# EAGLE schematic Main_Board_Schematic (EAGLE 9.7.0)

## Sheet 1 of 8
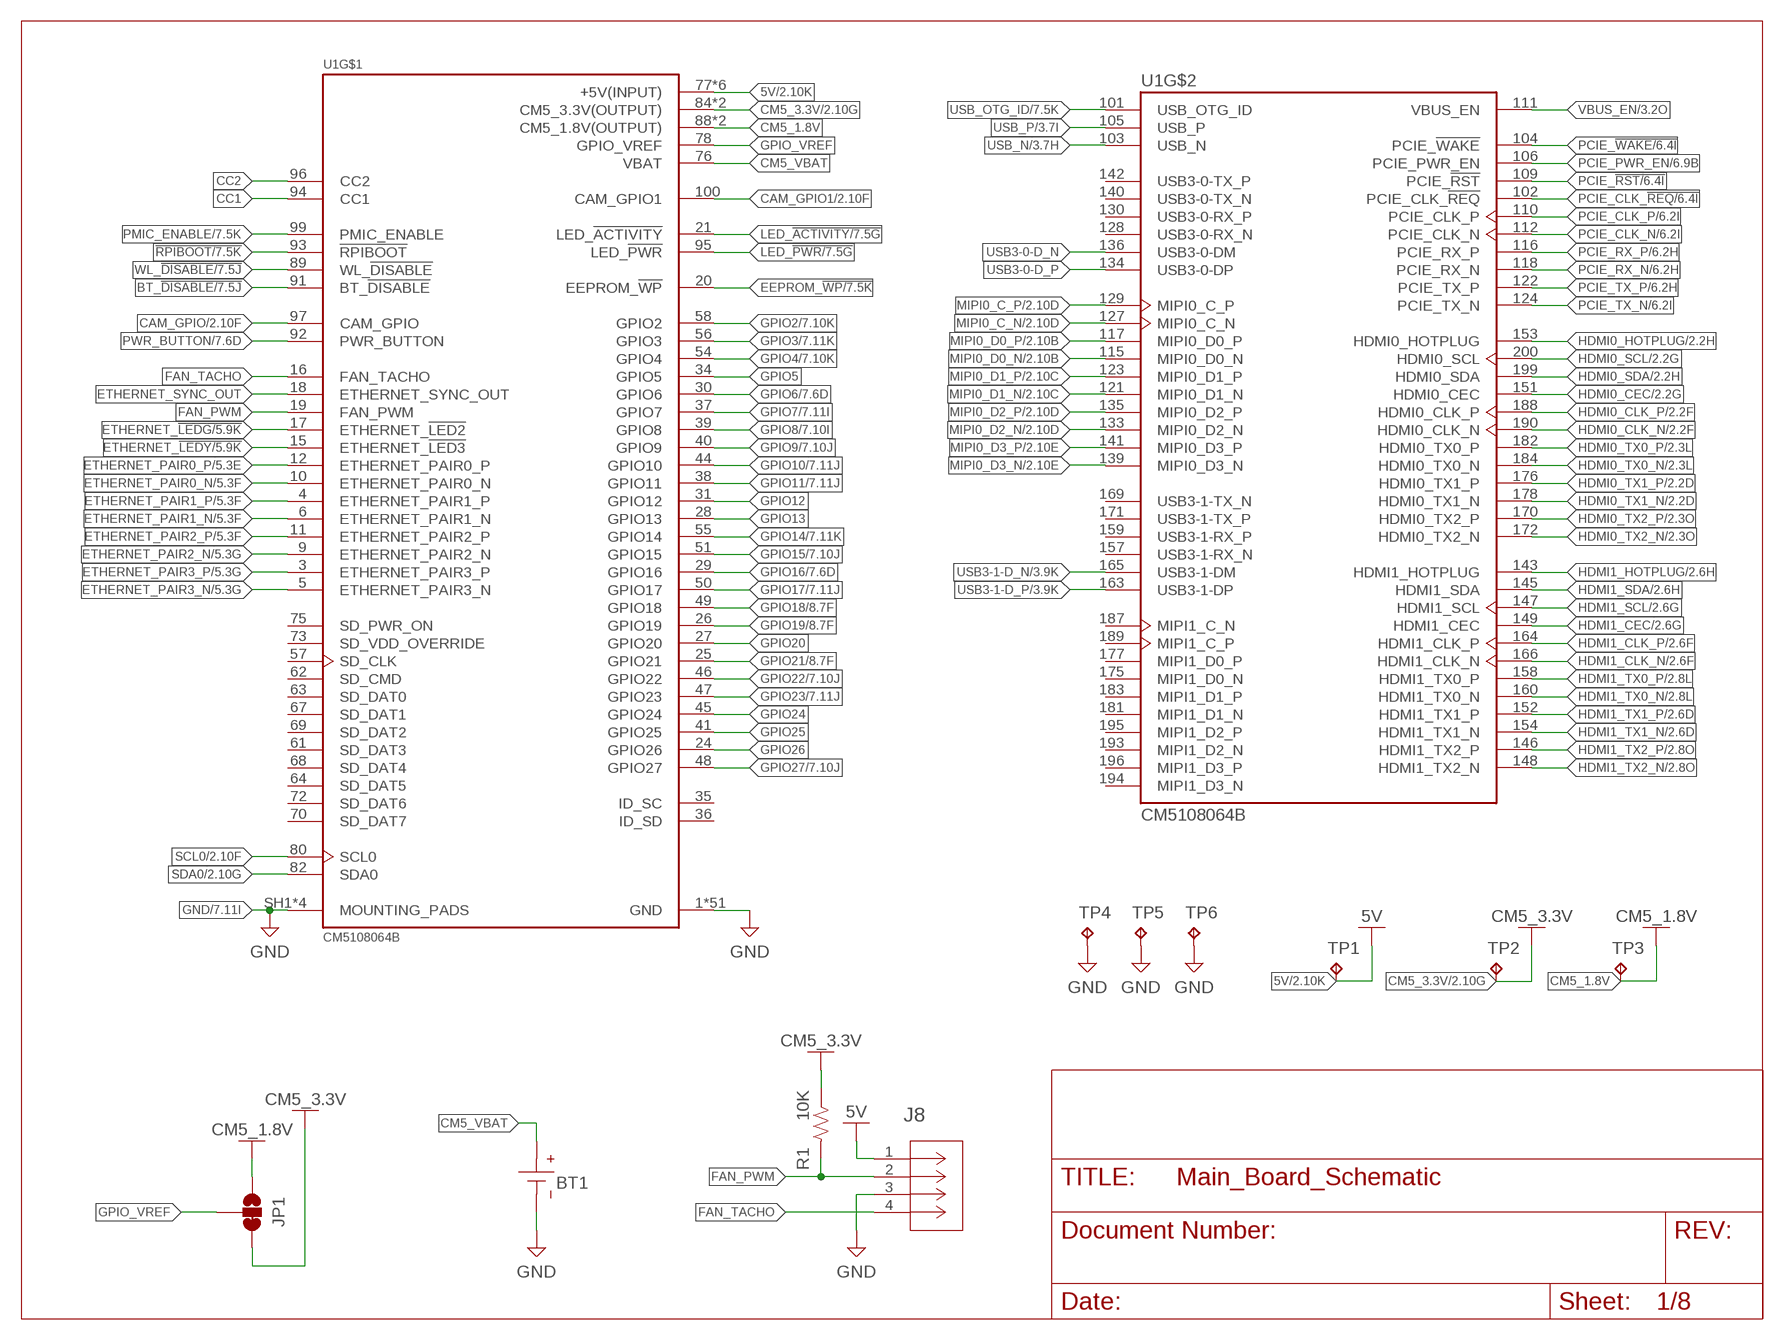
[diagram p0: schematic, sheet 1]

### Parts
BT1  COIN-CELL-SMT-3P-3002-BR2016  [BAT_3002]
J8  SM04B-SRSS-TBCONN_SM04B-SRSS-TB_JST  [CONN_SM04B-SRSS-TB_JST]
JP1  JUMPER-SMT_3_1-NC_TRACE_SILK  [SMT-JUMPER_3_1-NC_TRACE_SILK]
R1  10K  R-US_CHIP-0805(2012-METRIC)  [RESC2012X65]
TP1  TPB1,27  [B1,27]
TP2  TPB1,27  [B1,27]
TP3  TPB1,27  [B1,27]
TP4  TPB1,27  [B1,27]
TP5  TPB1,27  [B1,27]
TP6  TPB1,27  [B1,27]
U1  CM5108064B  [MODULE_CM5108064B]

### Nets
5V: J8.1 TP1.TP U1.77(+5V(INPUT)) U1.79(+5V(INPUT)) U1.81(+5V(INPUT)) U1.83(+5V(INPUT)) U1.85(+5V(INPUT)) U1.87(+5V(INPUT)) ; also sheet 2,3,6,7,8
!RPIBOOT: U1.93(!RPIBOOT) ; also sheet 7
BT_!DISABLE: U1.91(BT_!DISABLE) ; also sheet 7
CAM_GPIO: U1.97(CAM_GPIO) ; also sheet 2
CAM_GPIO1: U1.100(CAM_GPIO1) ; also sheet 2
CC1: U1.94(CC1)
CC2: U1.96(CC2)
CM5_1.8V: JP1.1 TP3.TP U1.88(CM5_1.8V(OUTPUT)) U1.90(CM5_1.8V(OUTPUT))
CM5_3.3V: JP1.3 R1.2 TP2.TP U1.84(CM5_3.3V(OUTPUT)) U1.86(CM5_3.3V(OUTPUT)) ; also sheet 2,3,4,5,7,8
CM5_VBAT: BT1.P1(+) BT1.P(+) U1.76(VBAT)
EEPROM_!WP: U1.20(EEPROM_!WP) ; also sheet 7
ETHERNET_!LEDG: U1.17(ETHERNET_!LED2) ; also sheet 5
ETHERNET_!LEDY: U1.15(ETHERNET_!LED3) ; also sheet 5
ETHERNET_PAIR0_N [100 ohm]: U1.10(ETHERNET_PAIR0_N) ; also sheet 5
ETHERNET_PAIR0_P [100 ohm]: U1.12(ETHERNET_PAIR0_P) ; also sheet 5
ETHERNET_PAIR1_N [100 ohm]: U1.6(ETHERNET_PAIR1_N) ; also sheet 5
ETHERNET_PAIR1_P [100 ohm]: U1.4(ETHERNET_PAIR1_P) ; also sheet 5
ETHERNET_PAIR2_N [100 ohm]: U1.9(ETHERNET_PAIR2_N) ; also sheet 5
ETHERNET_PAIR2_P [100 ohm]: U1.11(ETHERNET_PAIR2_P) ; also sheet 5
ETHERNET_PAIR3_N [100 ohm]: U1.5(ETHERNET_PAIR3_N) ; also sheet 5
ETHERNET_PAIR3_P [100 ohm]: U1.3(ETHERNET_PAIR3_P) ; also sheet 5
ETHERNET_SYNC_OUT: U1.18(ETHERNET_SYNC_OUT)
FAN_PWM: J8.2 R1.1 U1.19(FAN_PWM)
FAN_TACHO: J8.4 U1.16(FAN_TACHO)
GND: BT1.N(-) J8.3 TP4.TP TP5.TP TP6.TP U1.1(GND) U1.2(GND) U1.7(GND) U1.8(GND) U1.13(GND) U1.14(GND) U1.22(GND) U1.23(GND) U1.32(GND) U1.33(GND) U1.42(GND) U1.43(GND) U1.52(GND) U1.53(GND) U1.59(GND) U1.60(GND) U1.65(GND) U1.66(GND) U1.71(GND) U1.74(GND) U1.98(GND) U1.107(GND) U1.108(GND) U1.113(GND) U1.114(GND) U1.119(GND) U1.120(GND) U1.125(GND) U1.126(GND) U1.131(GND) U1.132(GND) U1.137(GND) U1.138(GND) U1.144(GND) U1.150(GND) U1.155(GND) U1.156(GND) U1.161(GND) U1.162(GND) U1.167(GND) U1.168(GND) U1.173(GND) U1.174(GND) U1.179(GND) U1.180(GND) U1.185(GND) U1.186(GND) U1.191(GND) U1.192(GND) U1.197(GND) U1.198(GND) U1.SH1(MOUNTING_PADS) U1.SH2(MOUNTING_PADS) U1.SH3(MOUNTING_PADS) U1.SH4(MOUNTING_PADS) ; also sheet 2,3,4,5,6,7,8
GPIO2: U1.58(GPIO2) ; also sheet 7
GPIO3: U1.56(GPIO3) ; also sheet 7
GPIO4: U1.54(GPIO4) ; also sheet 7
GPIO5: U1.34(GPIO5)
GPIO6: U1.30(GPIO6) ; also sheet 7
GPIO7: U1.37(GPIO7) ; also sheet 7
GPIO8: U1.39(GPIO8) ; also sheet 7
GPIO9: U1.40(GPIO9) ; also sheet 7
GPIO10: U1.44(GPIO10) ; also sheet 7
GPIO11: U1.38(GPIO11) ; also sheet 7
GPIO12: U1.31(GPIO12)
GPIO13: U1.28(GPIO13)
GPIO14: U1.55(GPIO14) ; also sheet 7
GPIO15: U1.51(GPIO15) ; also sheet 7
GPIO16: U1.29(GPIO16) ; also sheet 7
GPIO17: U1.50(GPIO17) ; also sheet 7
GPIO18: U1.49(GPIO18) ; also sheet 8
GPIO19: U1.26(GPIO19) ; also sheet 8
GPIO20: U1.27(GPIO20)
GPIO21: U1.25(GPIO21) ; also sheet 8
GPIO22: U1.46(GPIO22) ; also sheet 7
GPIO23: U1.47(GPIO23) ; also sheet 7
GPIO24: U1.45(GPIO24)
GPIO25: U1.41(GPIO25)
GPIO26: U1.24(GPIO26)
GPIO27: U1.48(GPIO27) ; also sheet 7
GPIO_VREF: JP1.2 U1.78(GPIO_VREF)
HDMI0_CEC: U1.151(HDMI0_CEC) ; also sheet 2
HDMI0_CLK_N [100 ohm]: U1.190(HDMI0_CLK_N) ; also sheet 2
HDMI0_CLK_P [100 ohm]: U1.188(HDMI0_CLK_P) ; also sheet 2
HDMI0_HOTPLUG: U1.153(HDMI0_HOTPLUG) ; also sheet 2
HDMI0_SCL: U1.200(HDMI0_SCL) ; also sheet 2
HDMI0_SDA: U1.199(HDMI0_SDA) ; also sheet 2
HDMI0_TX0_N [100 ohm]: U1.184(HDMI0_TX0_N) ; also sheet 2
HDMI0_TX0_P [100 ohm]: U1.182(HDMI0_TX0_P) ; also sheet 2
HDMI0_TX1_N [100 ohm]: U1.178(HDMI0_TX1_N) ; also sheet 2
HDMI0_TX1_P [100 ohm]: U1.176(HDMI0_TX1_P) ; also sheet 2
HDMI0_TX2_N [100 ohm]: U1.172(HDMI0_TX2_N) ; also sheet 2
HDMI0_TX2_P [100 ohm]: U1.170(HDMI0_TX2_P) ; also sheet 2
HDMI1_CEC: U1.149(HDMI1_CEC) ; also sheet 2
HDMI1_CLK_N [100 ohm]: U1.166(HDMI1_CLK_N) ; also sheet 2
HDMI1_CLK_P [100 ohm]: U1.164(HDMI1_CLK_P) ; also sheet 2
HDMI1_HOTPLUG: U1.143(HDMI1_HOTPLUG) ; also sheet 2
HDMI1_SCL: U1.147(HDMI1_SCL) ; also sheet 2
HDMI1_SDA: U1.145(HDMI1_SDA) ; also sheet 2
HDMI1_TX0_N [100 ohm]: U1.160(HDMI1_TX0_N) ; also sheet 2
HDMI1_TX0_P [100 ohm]: U1.158(HDMI1_TX0_P) ; also sheet 2
HDMI1_TX1_N [100 ohm]: U1.154(HDMI1_TX1_N) ; also sheet 2
HDMI1_TX1_P [100 ohm]: U1.152(HDMI1_TX1_P) ; also sheet 2
HDMI1_TX2_N [100 ohm]: U1.148(HDMI1_TX2_N) ; also sheet 2
HDMI1_TX2_P [100 ohm]: U1.146(HDMI1_TX2_P) ; also sheet 2
LED_!ACTIVITY: U1.21(LED_!ACTIVITY) ; also sheet 7
LED_!PWR: U1.95(LED_!PWR) ; also sheet 7
MIPI0_C_N [100 ohm]: U1.127(MIPI0_C_N) ; also sheet 2
MIPI0_C_P [100 ohm]: U1.129(MIPI0_C_P) ; also sheet 2
MIPI0_D0_N [100 ohm]: U1.115(MIPI0_D0_N) ; also sheet 2
MIPI0_D0_P [100 ohm]: U1.117(MIPI0_D0_P) ; also sheet 2
MIPI0_D1_N [100 ohm]: U1.121(MIPI0_D1_N) ; also sheet 2
MIPI0_D1_P [100 ohm]: U1.123(MIPI0_D1_P) ; also sheet 2
MIPI0_D2_N [100 ohm]: U1.133(MIPI0_D2_N) ; also sheet 2
MIPI0_D2_P [100 ohm]: U1.135(MIPI0_D2_P) ; also sheet 2
MIPI0_D3_N [100 ohm]: U1.139(MIPI0_D3_N) ; also sheet 2
MIPI0_D3_P [100 ohm]: U1.141(MIPI0_D3_P) ; also sheet 2
PCIE_!RST: U1.109(PCIE_!RST) ; also sheet 6
PCIE_!WAKE: U1.104(PCIE_!WAKE) ; also sheet 6
PCIE_CLK_!REQ: U1.102(PCIE_CLK_!REQ) ; also sheet 6
PCIE_CLK_N [90 ohm]: U1.112(PCIE_CLK_N) ; also sheet 6
PCIE_CLK_P [90 ohm]: U1.110(PCIE_CLK_P) ; also sheet 6
PCIE_PWR_EN: U1.106(PCIE_PWR_EN) ; also sheet 6
PCIE_RX_N [90 ohm]: U1.118(PCIE_RX_N) ; also sheet 6
PCIE_RX_P [90 ohm]: U1.116(PCIE_RX_P) ; also sheet 6
PCIE_TX_N [90 ohm]: U1.124(PCIE_TX_N) ; also sheet 6
PCIE_TX_P [90 ohm]: U1.122(PCIE_TX_P) ; also sheet 6
PMIC_ENABLE: U1.99(PMIC_ENABLE) ; also sheet 7
PWR_BUTTON: U1.92(PWR_BUTTON) ; also sheet 7
SCL0: U1.80(SCL0) ; also sheet 2
SDA0: U1.82(SDA0) ; also sheet 2
USB3-0-D_N [90 ohm]: U1.136(USB3-0-DM)
USB3-0-D_P [90 ohm]: U1.134(USB3-0-DP)
USB3-1-D_N [90 ohm]: U1.165(USB3-1-DM) ; also sheet 3
USB3-1-D_P [90 ohm]: U1.163(USB3-1-DP) ; also sheet 3
USB_N [90 ohm]: U1.103(USB_N) ; also sheet 3
USB_OTG_ID: U1.101(USB_OTG_ID) ; also sheet 7
USB_P [90 ohm]: U1.105(USB_P) ; also sheet 3
VBUS_EN: U1.111(VBUS_EN) ; also sheet 3
WL_!DISABLE: U1.89(WL_!DISABLE) ; also sheet 7
Unconnected: U1.35(ID_SC) U1.36(ID_SD) U1.57(SD_CLK) U1.61(SD_DAT3) U1.62(SD_CMD) U1.63(SD_DAT0) U1.64(SD_DAT5) U1.67(SD_DAT1) U1.68(SD_DAT4) U1.69(SD_DAT2) U1.70(SD_DAT7) U1.72(SD_DAT6) U1.73(SD_VDD_OVERRIDE) U1.75(SD_PWR_ON) U1.128(USB3-0-RX_N) U1.130(USB3-0-RX_P) U1.140(USB3-0-TX_N) U1.142(USB3-0-TX_P) U1.157(USB3-1-RX_N) U1.159(USB3-1-RX_P) U1.169(USB3-1-TX_N) U1.171(USB3-1-TX_P) U1.175(MIPI1_D0_N) U1.177(MIPI1_D0_P) U1.181(MIPI1_D1_N) U1.183(MIPI1_D1_P) U1.187(MIPI1_C_N) U1.189(MIPI1_C_P) U1.193(MIPI1_D2_N) U1.194(MIPI1_D3_N) U1.195(MIPI1_D2_P) U1.196(MIPI1_D3_P)

## Sheet 2 of 8
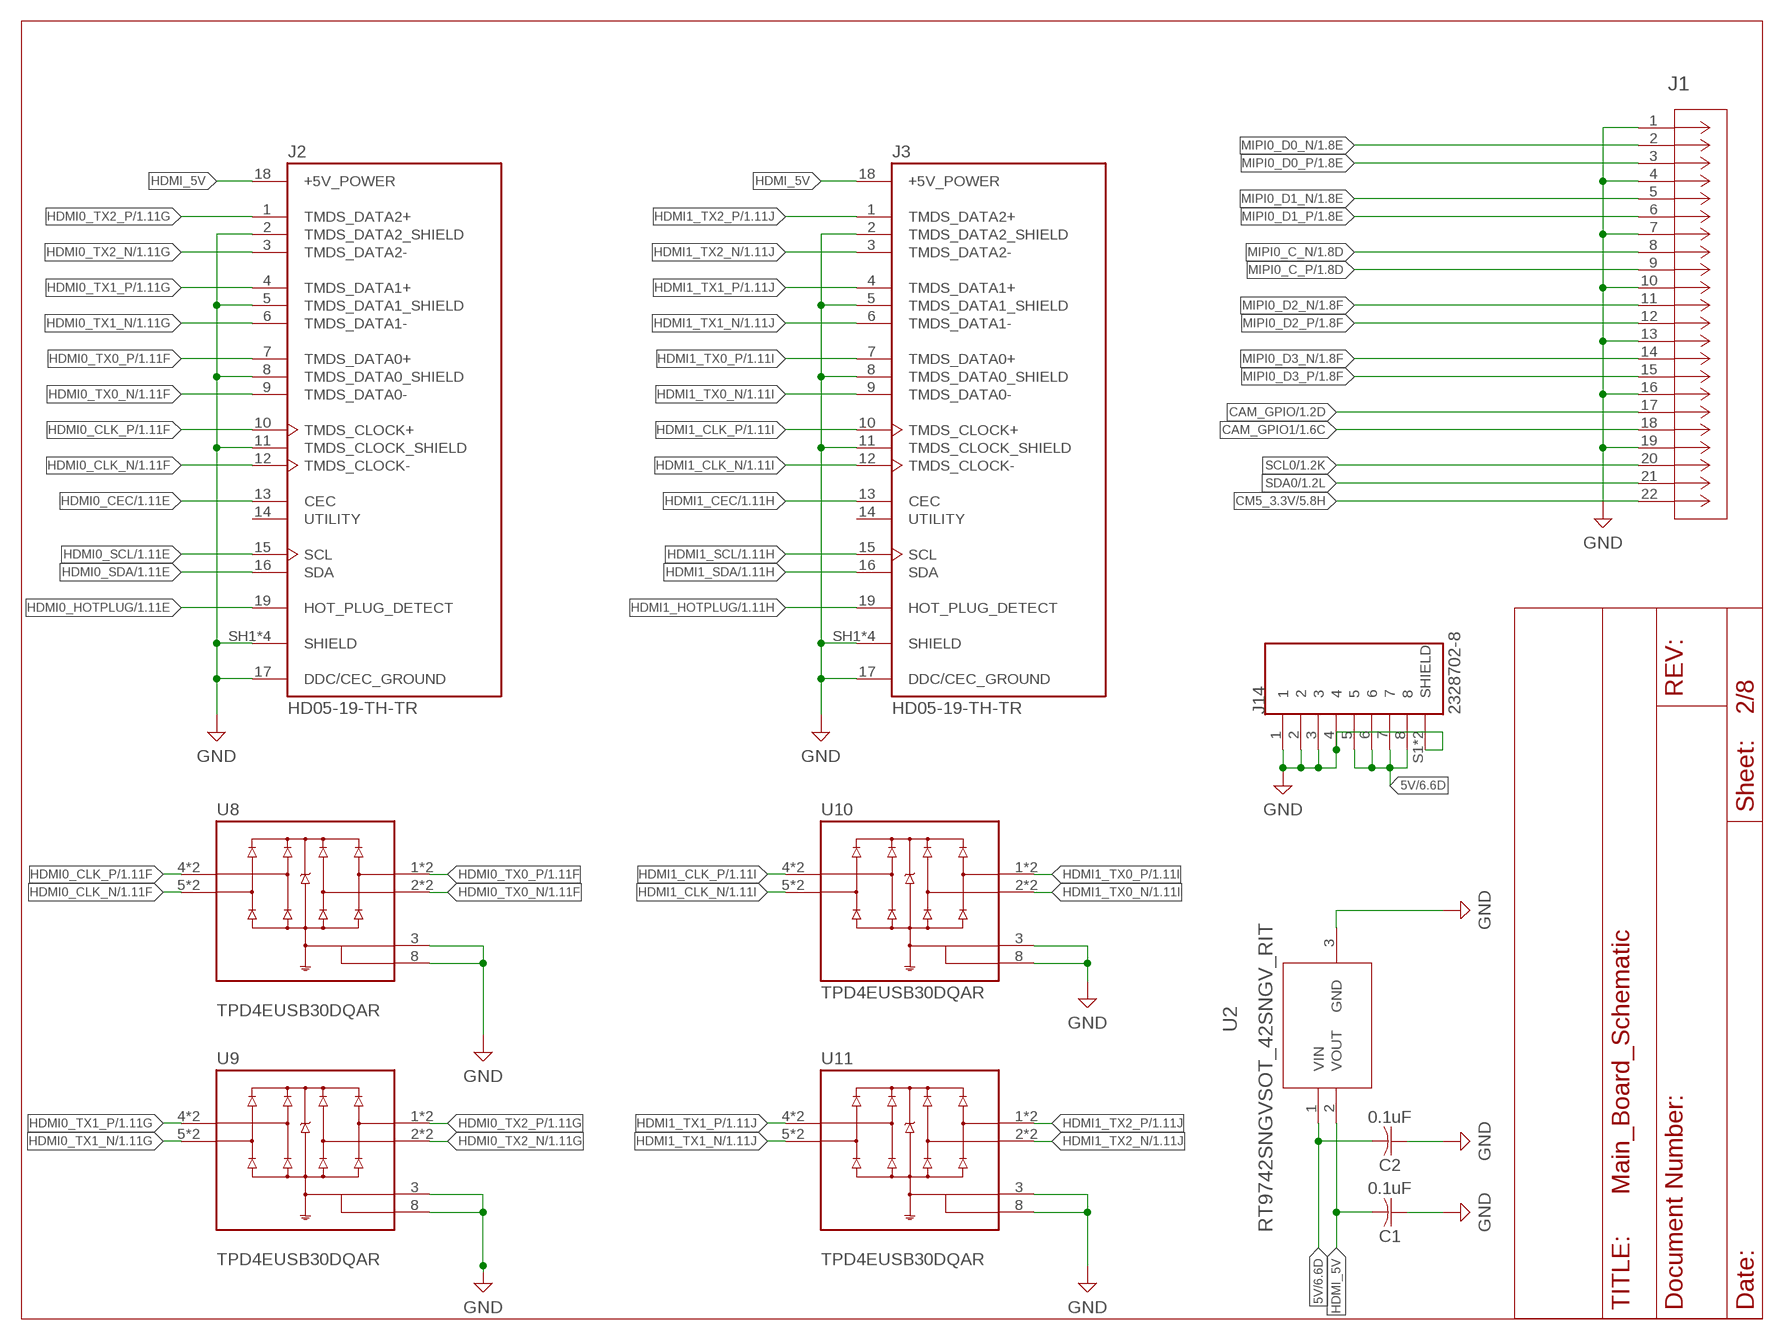
[diagram p1: schematic, sheet 2]

### Parts
C1  0.1uF  C-US_CHIP-0805(2012-METRIC)  [CAPC2012X110]
C2  0.1uF  C-US_CHIP-0805(2012-METRIC)  [CAPC2012X110]
J1  FH12-22S-0.5SH(55)CONN_FH12-22S-0.5SH(55)_HIR  [CONN_FH12-22S-0.5SH(55)_HIR]
J2  HD05-19-TH-TR  [SAMESKY_HD05-19-TH-TR]
J3  HD05-19-TH-TR  [SAMESKY_HD05-19-TH-TR]
J14  2328702-8  [TE_2328702-8]
U2  RT9742SNGVSOT_42SNGV_RIT  [SOT_42SNGV_RIT]
U8  TPD4EUSB30DQAR  [IC_TPD4EUSB30DQAR]
U9  TPD4EUSB30DQAR  [IC_TPD4EUSB30DQAR]
U10  TPD4EUSB30DQAR  [IC_TPD4EUSB30DQAR]
U11  TPD4EUSB30DQAR  [IC_TPD4EUSB30DQAR]

### Nets
5V: C2.2 J14.5 J14.6 J14.7 J14.8 U2.1(VIN) ; also sheet 1,3,6,7,8
CAM_GPIO: J1.17 ; also sheet 1
CAM_GPIO1: J1.18 ; also sheet 1
CM5_3.3V: J1.22 ; also sheet 1,3,4,5,7,8
GND: C1.1 C2.1 J1.1 J1.4 J1.7 J1.10 J1.13 J1.16 J1.19 J2.2(TMDS_DATA2_SHIELD) J2.5(TMDS_DATA1_SHIELD) J2.8(TMDS_DATA0_SHIELD) J2.11(TMDS_CLOCK_SHIELD) J2.17(DDC/CEC_GROUND) J2.SH1(SHIELD) J2.SH2(SHIELD) J2.SH3(SHIELD) J2.SH4(SHIELD) J3.2(TMDS_DATA2_SHIELD) J3.5(TMDS_DATA1_SHIELD) J3.8(TMDS_DATA0_SHIELD) J3.11(TMDS_CLOCK_SHIELD) J3.17(DDC/CEC_GROUND) J3.SH1(SHIELD) J3.SH2(SHIELD) J3.SH3(SHIELD) J3.SH4(SHIELD) J14.1 J14.2 J14.3 J14.4 J14.S1(SHIELD) J14.S2(SHIELD) U2.3(GND) U8.3(GND_3) U8.8(GND_8) U9.3(GND_3) U9.8(GND_8) U10.3(GND_3) U10.8(GND_8) U11.3(GND_3) U11.8(GND_8) ; also sheet 1,3,4,5,6,7,8
HDMI0_CEC: J2.13(CEC) ; also sheet 1
HDMI0_CLK_N [100 ohm]: J2.12(TMDS_CLOCK-) U8.5(D2-) U8.6(D2-) ; also sheet 1
HDMI0_CLK_P [100 ohm]: J2.10(TMDS_CLOCK+) U8.4(D2+) U8.7(D2+) ; also sheet 1
HDMI0_HOTPLUG: J2.19(HOT_PLUG_DETECT) ; also sheet 1
HDMI0_SCL: J2.15(SCL) ; also sheet 1
HDMI0_SDA: J2.16(SDA) ; also sheet 1
HDMI0_TX0_N [100 ohm]: J2.9(TMDS_DATA0-) U8.2(D1-) U8.9(D1-) ; also sheet 1
HDMI0_TX0_P [100 ohm]: J2.7(TMDS_DATA0+) U8.1(D1+) U8.10(D1+) ; also sheet 1
HDMI0_TX1_N [100 ohm]: J2.6(TMDS_DATA1-) U9.5(D2-) U9.6(D2-) ; also sheet 1
HDMI0_TX1_P [100 ohm]: J2.4(TMDS_DATA1+) U9.4(D2+) U9.7(D2+) ; also sheet 1
HDMI0_TX2_N [100 ohm]: J2.3(TMDS_DATA2-) U9.2(D1-) U9.9(D1-) ; also sheet 1
HDMI0_TX2_P [100 ohm]: J2.1(TMDS_DATA2+) U9.1(D1+) U9.10(D1+) ; also sheet 1
HDMI1_CEC: J3.13(CEC) ; also sheet 1
HDMI1_CLK_N [100 ohm]: J3.12(TMDS_CLOCK-) U10.5(D2-) U10.6(D2-) ; also sheet 1
HDMI1_CLK_P [100 ohm]: J3.10(TMDS_CLOCK+) U10.4(D2+) U10.7(D2+) ; also sheet 1
HDMI1_HOTPLUG: J3.19(HOT_PLUG_DETECT) ; also sheet 1
HDMI1_SCL: J3.15(SCL) ; also sheet 1
HDMI1_SDA: J3.16(SDA) ; also sheet 1
HDMI1_TX0_N [100 ohm]: J3.9(TMDS_DATA0-) U10.2(D1-) U10.9(D1-) ; also sheet 1
HDMI1_TX0_P [100 ohm]: J3.7(TMDS_DATA0+) U10.1(D1+) U10.10(D1+) ; also sheet 1
HDMI1_TX1_N [100 ohm]: J3.6(TMDS_DATA1-) U11.5(D2-) U11.6(D2-) ; also sheet 1
HDMI1_TX1_P [100 ohm]: J3.4(TMDS_DATA1+) U11.4(D2+) U11.7(D2+) ; also sheet 1
HDMI1_TX2_N [100 ohm]: J3.3(TMDS_DATA2-) U11.2(D1-) U11.9(D1-) ; also sheet 1
HDMI1_TX2_P [100 ohm]: J3.1(TMDS_DATA2+) U11.1(D1+) U11.10(D1+) ; also sheet 1
HDMI_5V: C1.2 J2.18(+5V_POWER) J3.18(+5V_POWER) U2.2(VOUT)
MIPI0_C_N [100 ohm]: J1.8 ; also sheet 1
MIPI0_C_P [100 ohm]: J1.9 ; also sheet 1
MIPI0_D0_N [100 ohm]: J1.2 ; also sheet 1
MIPI0_D0_P [100 ohm]: J1.3 ; also sheet 1
MIPI0_D1_N [100 ohm]: J1.5 ; also sheet 1
MIPI0_D1_P [100 ohm]: J1.6 ; also sheet 1
MIPI0_D2_N [100 ohm]: J1.11 ; also sheet 1
MIPI0_D2_P [100 ohm]: J1.12 ; also sheet 1
MIPI0_D3_N [100 ohm]: J1.14 ; also sheet 1
MIPI0_D3_P [100 ohm]: J1.15 ; also sheet 1
SCL0: J1.20 ; also sheet 1
SDA0: J1.21 ; also sheet 1
Unconnected: J2.14(UTILITY) J3.14(UTILITY)

## Sheet 3 of 8
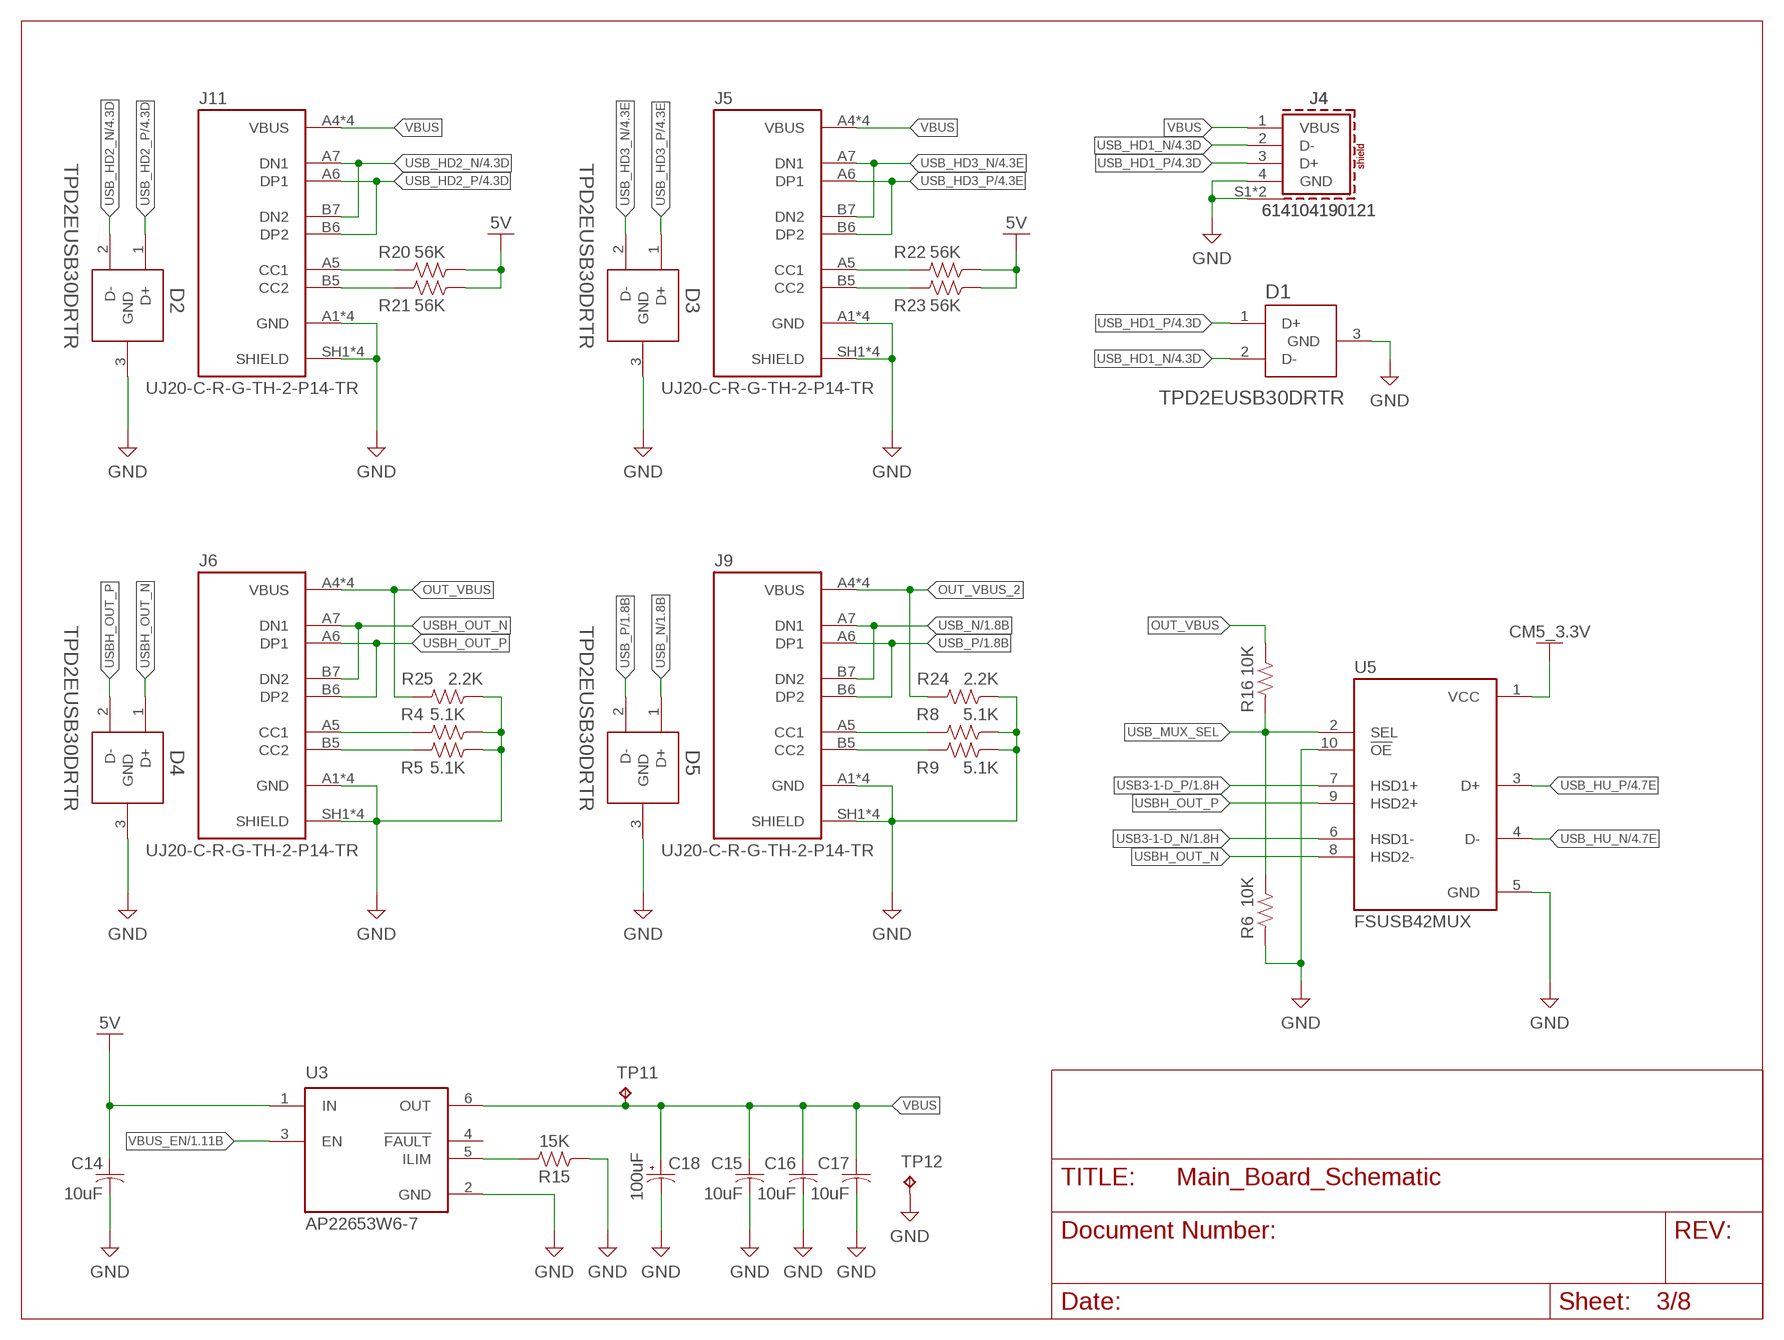
[diagram p2: schematic, sheet 3]

### Parts
C14  10uF  C-US_CHIP-1206(3216-METRIC)  [CAPC3216X135]
C15  10uF  C-US_CHIP-1206(3216-METRIC)  [CAPC3216X135]
C16  10uF  C-US_CHIP-1206(3216-METRIC)  [CAPC3216X135]
C17  10uF  C-US_CHIP-1206(3216-METRIC)  [CAPC3216X135]
C18  100uF  C-POL-US_TANTALUM-1411(3528-METRIC)  [CAPMP3528X210N]
D1  TPD2EUSB30DRTR  [SOTFL35P100X50-3N]
D2  TPD2EUSB30DRTR  [SOTFL35P100X50-3N]
D3  TPD2EUSB30DRTR  [SOTFL35P100X50-3N]
D4  TPD2EUSB30DRTR  [SOTFL35P100X50-3N]
D5  TPD2EUSB30DRTR  [SOTFL35P100X50-3N]
J4  614104190121  [614104190121]
J5  UJ20-C-R-G-TH-2-P14-TR  [SAMESKY_UJ20-C-R-G-TH-2-P14-TR]
J6  UJ20-C-R-G-TH-2-P14-TR  [SAMESKY_UJ20-C-R-G-TH-2-P14-TR]
J9  UJ20-C-R-G-TH-2-P14-TR  [SAMESKY_UJ20-C-R-G-TH-2-P14-TR]
J11  UJ20-C-R-G-TH-2-P14-TR  [SAMESKY_UJ20-C-R-G-TH-2-P14-TR]
R4  5.1K  R-US_CHIP-0805(2012-METRIC)  [RESC2012X65]
R5  5.1K  R-US_CHIP-0805(2012-METRIC)  [RESC2012X65]
R6  10K  R-US_CHIP-0805(2012-METRIC)  [RESC2012X65]
R8  5.1K  R-US_CHIP-0805(2012-METRIC)  [RESC2012X65]
R9  5.1K  R-US_CHIP-0805(2012-METRIC)  [RESC2012X65]
R15  15K  R-US_CHIP-0805(2012-METRIC)  [RESC2012X65]
R16  10K  R-US_CHIP-0805(2012-METRIC)  [RESC2012X65]
R20  56K  R-US_CHIP-0805(2012-METRIC)  [RESC2012X65]
R21  56K  R-US_CHIP-0805(2012-METRIC)  [RESC2012X65]
R22  56K  R-US_CHIP-0805(2012-METRIC)  [RESC2012X65]
R23  56K  R-US_CHIP-0805(2012-METRIC)  [RESC2012X65]
R24  2.2K  R-US_CHIP-0805(2012-METRIC)  [RESC2012X65]
R25  2.2K  R-US_CHIP-0805(2012-METRIC)  [RESC2012X65]
TP11  TPB1,27  [B1,27]
TP12  TPB1,27  [B1,27]
U3  AP22653W6-7  [SOT95P280X145-6N]
U5  FSUSB42MUX  [SOP50P490X110-10N]

### Nets
5V: C14.1 R20.1 R21.1 R22.1 R23.1 U3.1(IN) ; also sheet 1,2,6,7,8
CM5_3.3V: U5.1(VCC) ; also sheet 1,2,4,5,7,8
GND: C14.2 C15.2 C16.2 C17.2 C18.2(-) D1.3(GND) D2.3(GND) D3.3(GND) D4.3(GND) D5.3(GND) J4.4(GND) J4.S1(SHIELD) J4.S2(SHIELD) J5.A1(GND) J5.A12(GND) J5.B1(GND) J5.B12(GND) J5.SH1(SHIELD) J5.SH2(SHIELD) J5.SH3(SHIELD) J5.SH4(SHIELD) J6.A1(GND) J6.A12(GND) J6.B1(GND) J6.B12(GND) J6.SH1(SHIELD) J6.SH2(SHIELD) J6.SH3(SHIELD) J6.SH4(SHIELD) J9.A1(GND) J9.A12(GND) J9.B1(GND) J9.B12(GND) J9.SH1(SHIELD) J9.SH2(SHIELD) J9.SH3(SHIELD) J9.SH4(SHIELD) J11.A1(GND) J11.A12(GND) J11.B1(GND) J11.B12(GND) J11.SH1(SHIELD) J11.SH2(SHIELD) J11.SH3(SHIELD) J11.SH4(SHIELD) R4.1 R5.1 R6.1 R8.1 R9.1 R15.1 R24.1 R25.1 TP12.TP U3.2(GND) U5.5(GND) U5.10(!OE) ; also sheet 1,2,4,5,6,7,8
N$1: J11.A5(CC1) R20.2
N$2: J5.A5(CC1) R22.2
N$5: J9.A5(CC1) R8.2
N$6: J9.B5(CC2) R9.2
N$11: J6.A5(CC1) R4.2
N$12: J6.B5(CC2) R5.2
N$14: R15.2 U3.5(ILIM)
N$17: J5.B5(CC2) R23.2
N$18: J11.B5(CC2) R21.2
OUT_VBUS: J6.A4(VBUS) J6.A9(VBUS) J6.B4(VBUS) J6.B9(VBUS) R16.2 R25.2
OUT_VBUS_2: J9.A4(VBUS) J9.A9(VBUS) J9.B4(VBUS) J9.B9(VBUS) R24.2
USB3-1-D_N [90 ohm]: U5.6(HSD1-) ; also sheet 1
USB3-1-D_P [90 ohm]: U5.7(HSD1+) ; also sheet 1
USB_HD1_N [90 ohm]: D1.2(D-) J4.2(D-) ; also sheet 4
USB_HD1_P [90 ohm]: D1.1(D+) J4.3(D+) ; also sheet 4
USB_HD2_N [90 ohm]: D2.2(D-) J11.A7(DN1) J11.B7(DN2) ; also sheet 4
USB_HD2_P [90 ohm]: D2.1(D+) J11.A6(DP1) J11.B6(DP2) ; also sheet 4
USB_HD3_N [90 ohm]: D3.2(D-) J5.A7(DN1) J5.B7(DN2) ; also sheet 4
USB_HD3_P [90 ohm]: D3.1(D+) J5.A6(DP1) J5.B6(DP2) ; also sheet 4
USB_HU_N [90 ohm]: U5.4(D-) ; also sheet 4
USB_HU_P [90 ohm]: U5.3(D+) ; also sheet 4
USB_MUX_SEL: R6.2 R16.1 U5.2(SEL)
USB_N [90 ohm]: D5.1(D+) J9.A7(DN1) J9.B7(DN2) ; also sheet 1
USB_P [90 ohm]: D5.2(D-) J9.A6(DP1) J9.B6(DP2) ; also sheet 1
USBH_OUT_N [90 ohm]: D4.1(D+) J6.A7(DN1) J6.B7(DN2) U5.8(HSD2-)
USBH_OUT_P [90 ohm]: D4.2(D-) J6.A6(DP1) J6.B6(DP2) U5.9(HSD2+)
VBUS: C15.1 C16.1 C17.1 C18.1(+) J4.1(VBUS) J5.A4(VBUS) J5.A9(VBUS) J5.B4(VBUS) J5.B9(VBUS) J11.A4(VBUS) J11.A9(VBUS) J11.B4(VBUS) J11.B9(VBUS) TP11.TP U3.6(OUT)
VBUS_EN: U3.3(EN) ; also sheet 1
Unconnected: U3.4(!FAULT)

## Sheet 4 of 8
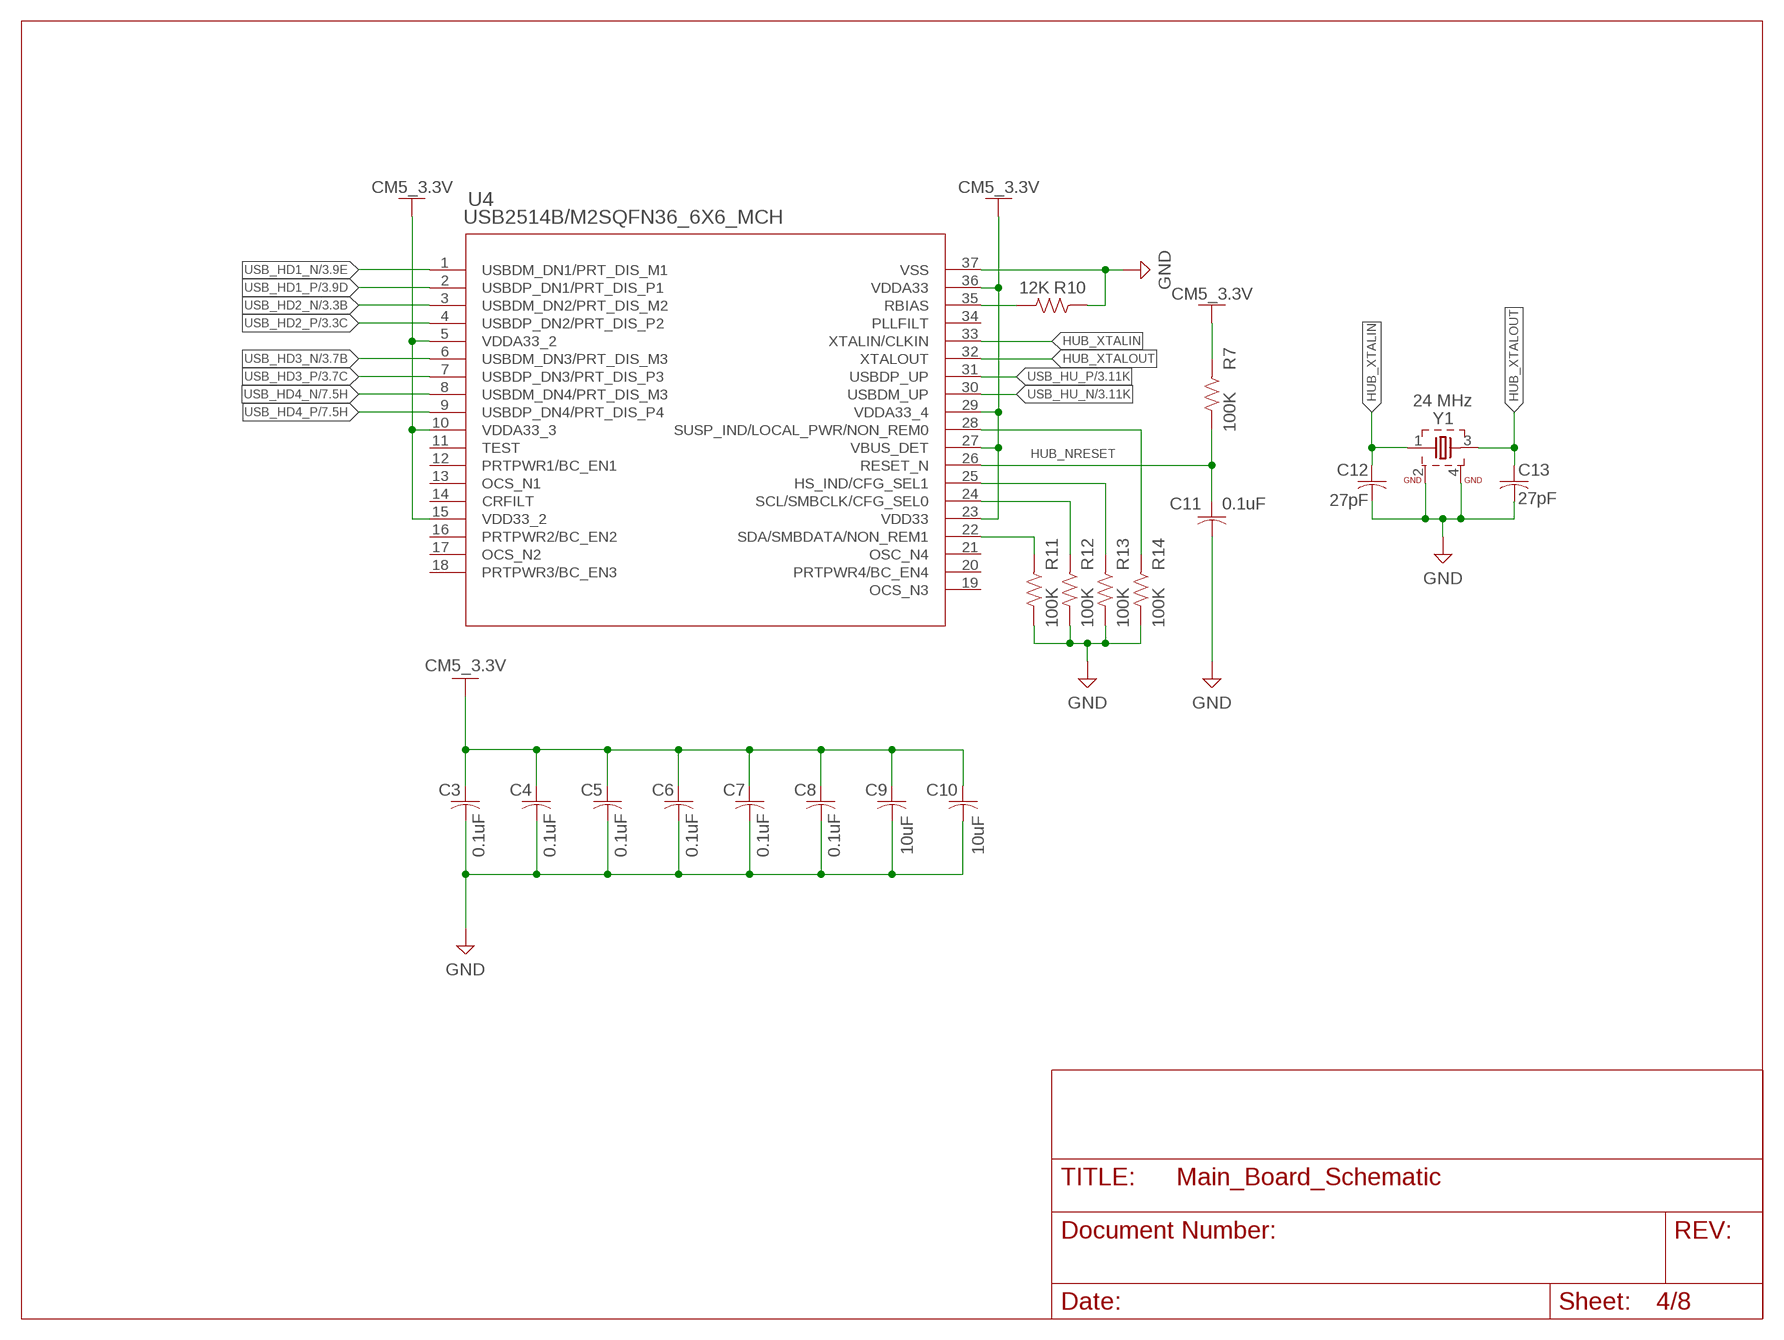
[diagram p3: schematic, sheet 4]

### Parts
C3  0.1uF  C-US_CHIP-0805(2012-METRIC)  [CAPC2012X110]
C4  0.1uF  C-US_CHIP-0805(2012-METRIC)  [CAPC2012X110]
C5  0.1uF  C-US_CHIP-0805(2012-METRIC)  [CAPC2012X110]
C6  0.1uF  C-US_CHIP-0805(2012-METRIC)  [CAPC2012X110]
C7  0.1uF  C-US_CHIP-0805(2012-METRIC)  [CAPC2012X110]
C8  0.1uF  C-US_CHIP-0805(2012-METRIC)  [CAPC2012X110]
C9  10uF  C-US_CHIP-1206(3216-METRIC)  [CAPC3216X135]
C10  10uF  C-US_CHIP-1206(3216-METRIC)  [CAPC3216X135]
C11  0.1uF  C-US_CHIP-0805(2012-METRIC)  [CAPC2012X110]
C12  27pF  C-US_CHIP-0805(2012-METRIC)  [CAPC2012X110]
C13  27pF  C-US_CHIP-0805(2012-METRIC)  [CAPC2012X110]
R7  100K  R-US_CHIP-0805(2012-METRIC)  [RESC2012X65]
R10  12K  R-US_CHIP-0805(2012-METRIC)  [RESC2012X65]
R11  100K  R-US_CHIP-0805(2012-METRIC)  [RESC2012X65]
R12  100K  R-US_CHIP-0805(2012-METRIC)  [RESC2012X65]
R13  100K  R-US_CHIP-0805(2012-METRIC)  [RESC2012X65]
R14  100K  R-US_CHIP-0805(2012-METRIC)  [RESC2012X65]
U4  USB2514B/M2SQFN36_6X6_MCH  [SQFN36_6X6_MCH]
Y1  24 MHz  WE-XTAL_CFPX-180_830058124  [WE-XTAL_CFPX-180]

### Nets
CM5_3.3V: C3.1 C4.1 C5.1 C6.1 C7.1 C8.1 C9.1 C10.1 R7.1 U4.5(VDDA33_2) U4.10(VDDA33_3) U4.15(VDD33_2) U4.23(VDD33) U4.27(VBUS_DET) U4.29(VDDA33_4) U4.36(VDDA33) ; also sheet 1,2,3,5,7,8
GND: C3.2 C4.2 C5.2 C6.2 C7.2 C8.2 C9.2 C10.2 C11.2 C12.2 C13.2 R10.1 R11.2 R12.2 R13.2 R14.2 U4.37(VSS) Y1.2(GND) Y1.4(GND1) ; also sheet 1,2,3,5,6,7,8
HUB_NRESET: C11.1 R7.2 U4.26(RESET_N)
HUB_XTALIN: C12.1 U4.33(XTALIN/CLKIN) Y1.1
HUB_XTALOUT: C13.1 U4.32(XTALOUT) Y1.3
N$3: R10.2 U4.35(RBIAS)
N$4: R11.1 U4.22(SDA/SMBDATA/NON_REM1)
N$7: R12.1 U4.24(SCL/SMBCLK/CFG_SEL0)
N$8: R13.1 U4.25(HS_IND/CFG_SEL1)
N$9: R14.1 U4.28(SUSP_IND/LOCAL_PWR/NON_REM0)
USB_HD1_N [90 ohm]: U4.1(USBDM_DN1/PRT_DIS_M1) ; also sheet 3
USB_HD1_P [90 ohm]: U4.2(USBDP_DN1/PRT_DIS_P1) ; also sheet 3
USB_HD2_N [90 ohm]: U4.3(USBDM_DN2/PRT_DIS_M2) ; also sheet 3
USB_HD2_P [90 ohm]: U4.4(USBDP_DN2/PRT_DIS_P2) ; also sheet 3
USB_HD3_N [90 ohm]: U4.6(USBDM_DN3/PRT_DIS_M3) ; also sheet 3
USB_HD3_P [90 ohm]: U4.7(USBDP_DN3/PRT_DIS_P3) ; also sheet 3
USB_HD4_N [90 ohm]: U4.8(USBDM_DN4/PRT_DIS_M3) ; also sheet 7
USB_HD4_P [90 ohm]: U4.9(USBDP_DN4/PRT_DIS_P4) ; also sheet 7
USB_HU_N [90 ohm]: U4.30(USBDM_UP) ; also sheet 3
USB_HU_P [90 ohm]: U4.31(USBDP_UP) ; also sheet 3
Unconnected: U4.11(TEST) U4.12(PRTPWR1/BC_EN1) U4.13(OCS_N1) U4.14(CRFILT) U4.16(PRTPWR2/BC_EN2) U4.17(OCS_N2) U4.18(PRTPWR3/BC_EN3) U4.19(OCS_N3) U4.20(PRTPWR4/BC_EN4) U4.21(OSC_N4) U4.34(PLLFILT)

## Sheet 5 of 8
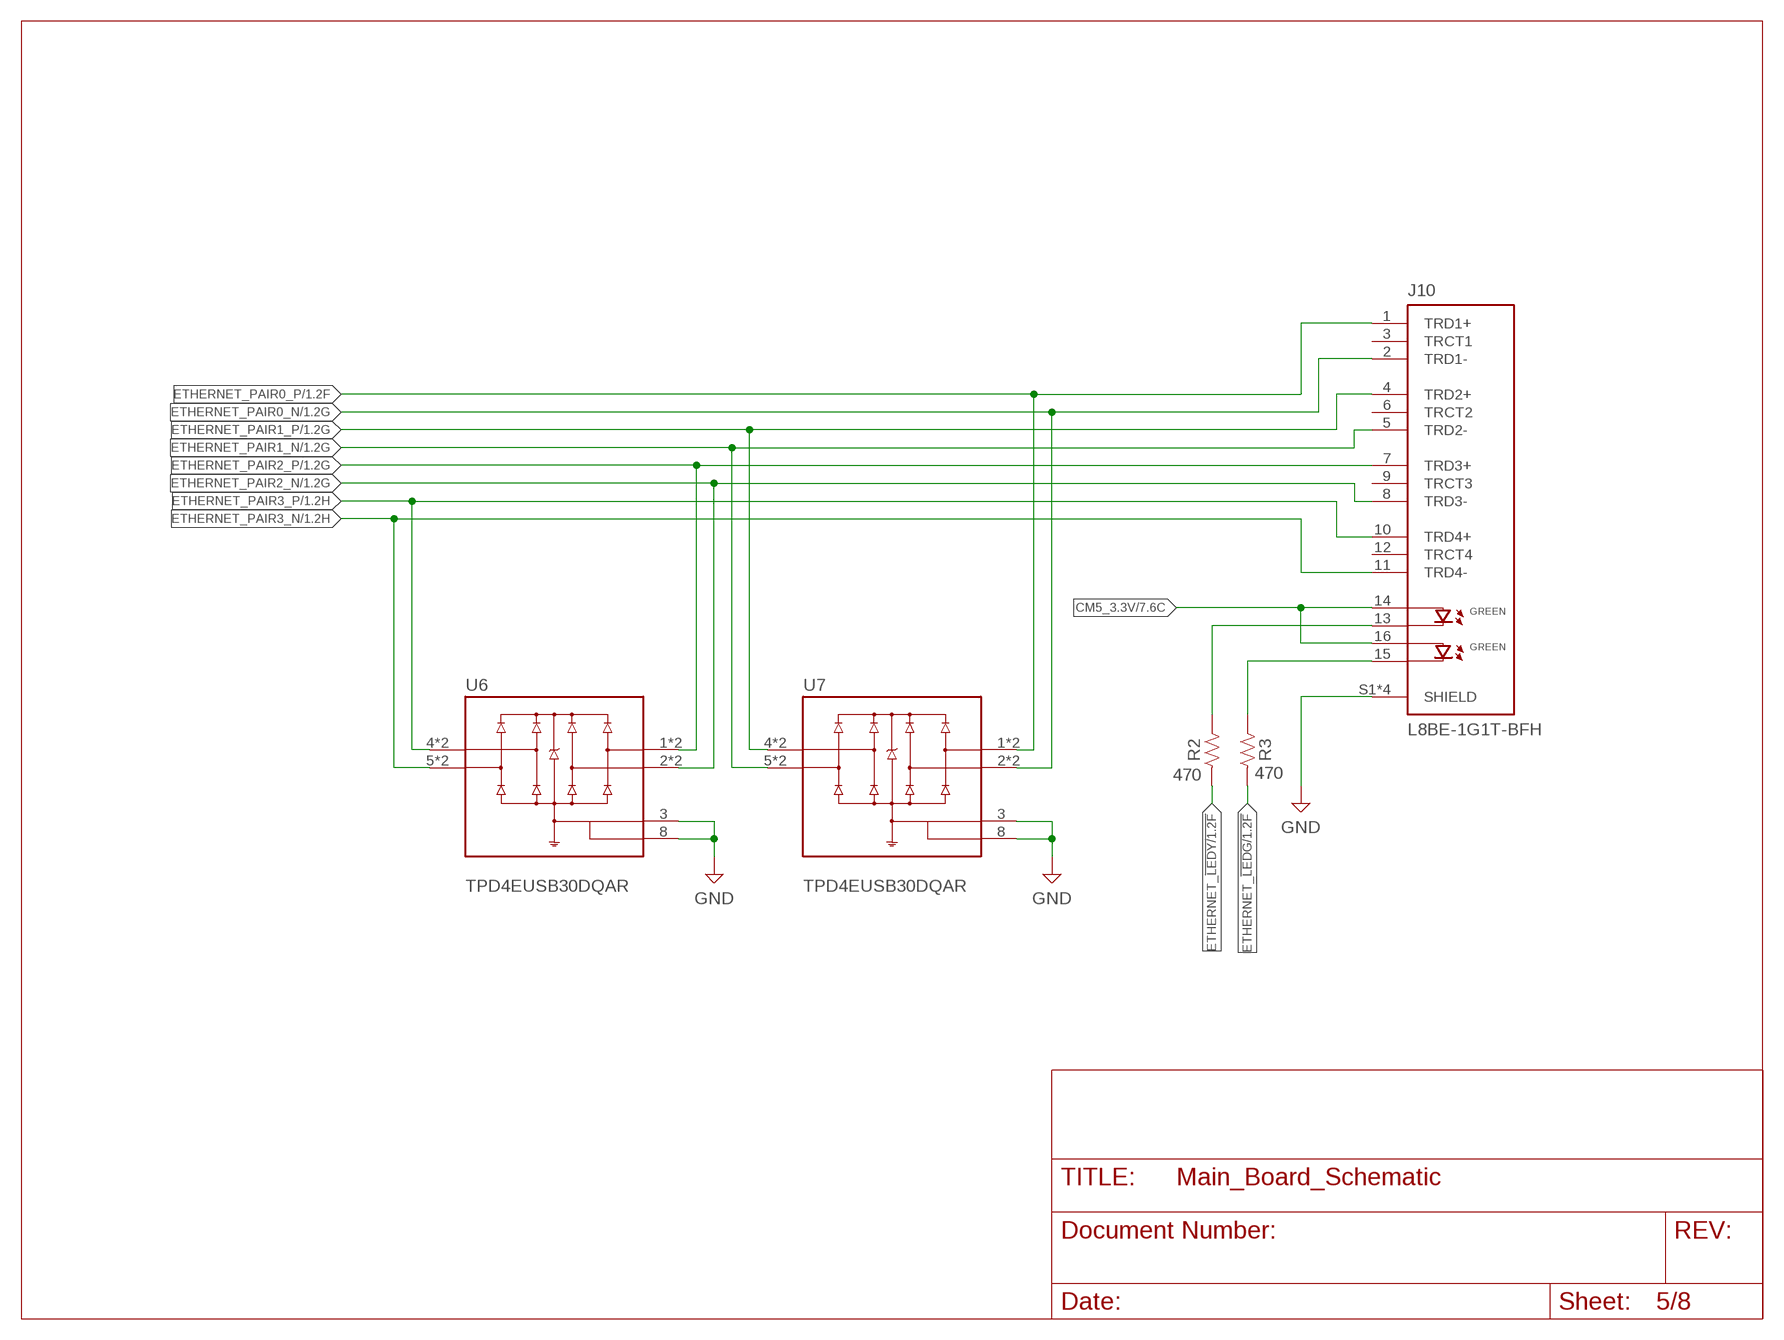
[diagram p4: schematic, sheet 5]

### Parts
J10  L8BE-1G1T-BFH  [BEL_L8BE-1G1T-BFH]
R2  470  R-US_CHIP-0805(2012-METRIC)  [RESC2012X65]
R3  470  R-US_CHIP-0805(2012-METRIC)  [RESC2012X65]
U6  TPD4EUSB30DQAR  [IC_TPD4EUSB30DQAR]
U7  TPD4EUSB30DQAR  [IC_TPD4EUSB30DQAR]

### Nets
CM5_3.3V: J10.14(GA_1) J10.16(GA_2) ; also sheet 1,2,3,4,7,8
ETHERNET_!LEDG: R3.1 ; also sheet 1
ETHERNET_!LEDY: R2.1 ; also sheet 1
ETHERNET_PAIR0_N [100 ohm]: J10.2(TRD1-) U7.2(D1-) U7.9(D1-) ; also sheet 1
ETHERNET_PAIR0_P [100 ohm]: J10.1(TRD1+) U7.1(D1+) U7.10(D1+) ; also sheet 1
ETHERNET_PAIR1_N [100 ohm]: J10.5(TRD2-) U7.5(D2-) U7.6(D2-) ; also sheet 1
ETHERNET_PAIR1_P [100 ohm]: J10.4(TRD2+) U7.4(D2+) U7.7(D2+) ; also sheet 1
ETHERNET_PAIR2_N [100 ohm]: J10.8(TRD3-) U6.2(D1-) U6.9(D1-) ; also sheet 1
ETHERNET_PAIR2_P [100 ohm]: J10.7(TRD3+) U6.1(D1+) U6.10(D1+) ; also sheet 1
ETHERNET_PAIR3_N [100 ohm]: J10.11(TRD4-) U6.5(D2-) U6.6(D2-) ; also sheet 1
ETHERNET_PAIR3_P [100 ohm]: J10.10(TRD4+) U6.4(D2+) U6.7(D2+) ; also sheet 1
GND: J10.S1(SHIELD) J10.S2(SHIELD) J10.S3(SHIELD) J10.S4(SHIELD) U6.3(GND_3) U6.8(GND_8) U7.3(GND_3) U7.8(GND_8) ; also sheet 1,2,3,4,6,7,8
N$15: J10.15(GK_2) R3.2
N$16: J10.13(GK_1) R2.2
Unconnected: J10.3(TRCT1) J10.6(TRCT2) J10.9(TRCT3) J10.12(TRCT4)

## Sheet 6 of 8
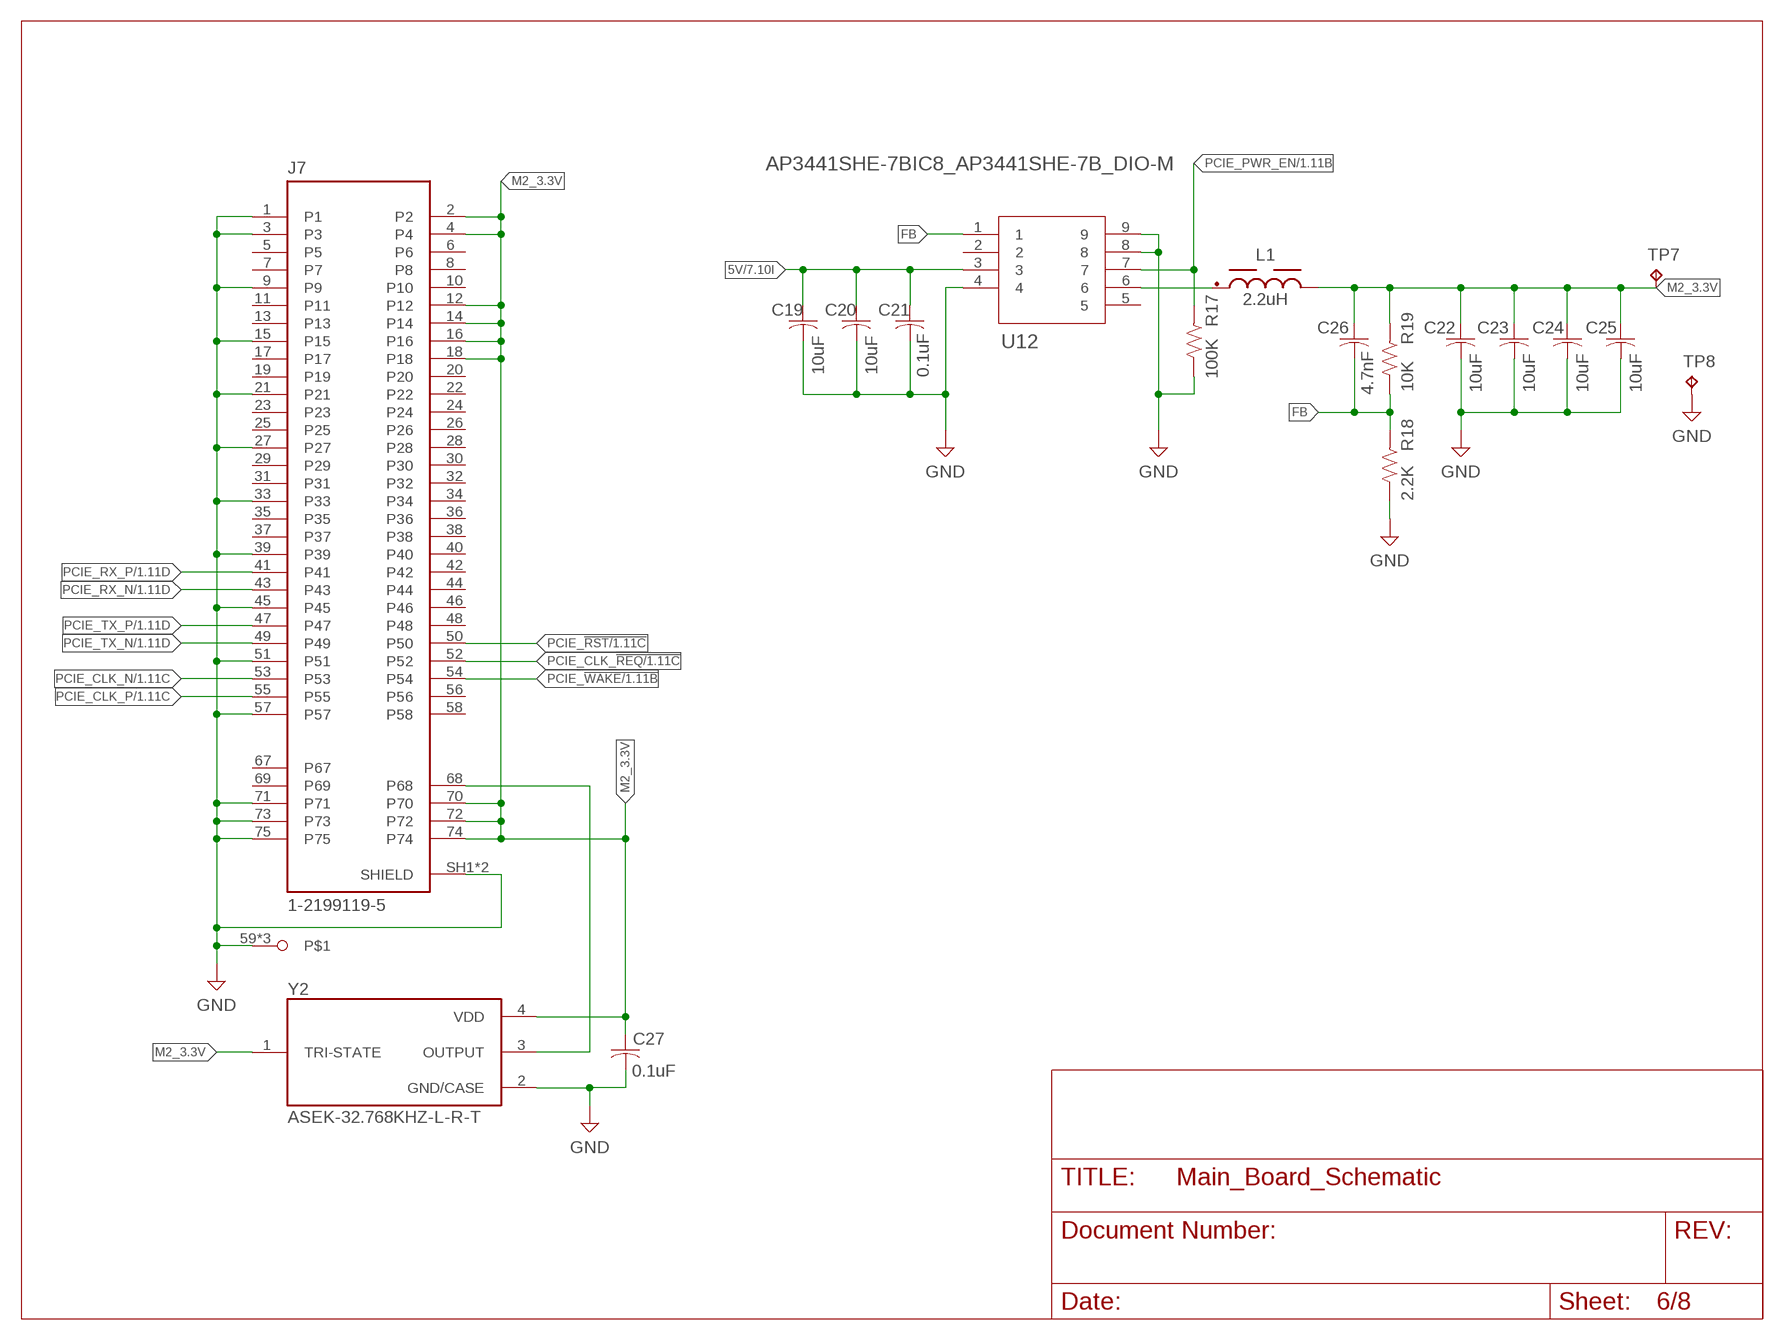
[diagram p5: schematic, sheet 6]

### Parts
C19  10uF  C-US_CHIP-1206(3216-METRIC)  [CAPC3216X135]
C20  10uF  C-US_CHIP-1206(3216-METRIC)  [CAPC3216X135]
C21  0.1uF  C-US_CHIP-0805(2012-METRIC)  [CAPC2012X110]
C22  10uF  C-US_CHIP-1206(3216-METRIC)  [CAPC3216X135]
C23  10uF  C-US_CHIP-1206(3216-METRIC)  [CAPC3216X135]
C24  10uF  C-US_CHIP-1206(3216-METRIC)  [CAPC3216X135]
C25  10uF  C-US_CHIP-1206(3216-METRIC)  [CAPC3216X135]
C26  4.7nF  C-US_CHIP-0805(2012-METRIC)  [CAPC2012X110]
C27  0.1uF  C-US_CHIP-0805(2012-METRIC)  [CAPC2012X110]
J7  1-2199119-5  [TE_1-2199119-5]
L1  2.2uH  WE-XHMI_5030_74439334022  [WE-XHMI_5030]
R17  100K  R-US_CHIP-0805(2012-METRIC)  [RESC2012X65]
R18  2.2K  R-US_CHIP-0805(2012-METRIC)  [RESC2012X65]
R19  10K  R-US_CHIP-0805(2012-METRIC)  [RESC2012X65]
TP7  TPB1,27  [B1,27]
TP8  TPB1,27  [B1,27]
U12  AP3441SHE-7BIC8_AP3441SHE-7B_DIO-M  [IC8_AP3441SHE-7B_DIO-M]
Y2  ASEK-32.768KHZ-L-R-T  [XTAL_ASEK-32.768KHZ-L-R-T]

### Nets
5V: C19.1 C20.1 C21.1 U12.3 ; also sheet 1,2,3,7,8
FB: C26.2 R18.1 R19.2 U12.1
GND: C19.2 C20.2 C21.2 C22.2 C23.2 C24.2 C25.2 C27.2 J7.1 J7.3 J7.9 J7.15 J7.21 J7.27 J7.33 J7.39 J7.45 J7.51 J7.57 J7.59 J7.60 J7.61 J7.71 J7.73 J7.75 J7.SH1(SHIELD) J7.SH2(SHIELD) R17.2 R18.2 TP8.TP U12.4 U12.8 U12.9 Y2.2(GND/CASE) ; also sheet 1,2,3,4,5,7,8
M2_3.3V: C22.1 C23.1 C24.1 C25.1 C26.1 C27.1 J7.2 J7.4 J7.12 J7.14 J7.16 J7.18 J7.70 J7.72 J7.74 L1.2 R19.1 TP7.TP Y2.1(TRI-STATE) Y2.4(VDD)
N$10: L1.1 U12.6
N$13: J7.68 Y2.3(OUTPUT)
PCIE_!RST: J7.50 ; also sheet 1
PCIE_!WAKE: J7.54 ; also sheet 1
PCIE_CLK_!REQ: J7.52 ; also sheet 1
PCIE_CLK_N [90 ohm]: J7.53 ; also sheet 1
PCIE_CLK_P [90 ohm]: J7.55 ; also sheet 1
PCIE_PWR_EN: R17.1 U12.7 ; also sheet 1
PCIE_RX_N [90 ohm]: J7.43 ; also sheet 1
PCIE_RX_P [90 ohm]: J7.41 ; also sheet 1
PCIE_TX_N [90 ohm]: J7.49 ; also sheet 1
PCIE_TX_P [90 ohm]: J7.47 ; also sheet 1
Unconnected: J7.5 J7.6 J7.7 J7.8 J7.10 J7.11 J7.13 J7.17 J7.19 J7.20 J7.22 J7.23 J7.24 J7.25 J7.26 J7.28 J7.29 J7.30 J7.31 J7.32 J7.34 J7.35 J7.36 J7.37 J7.38 J7.40 J7.42 J7.44 J7.46 J7.48 J7.56 J7.58 J7.67 J7.69 U12.2 U12.5

## Sheet 7 of 8
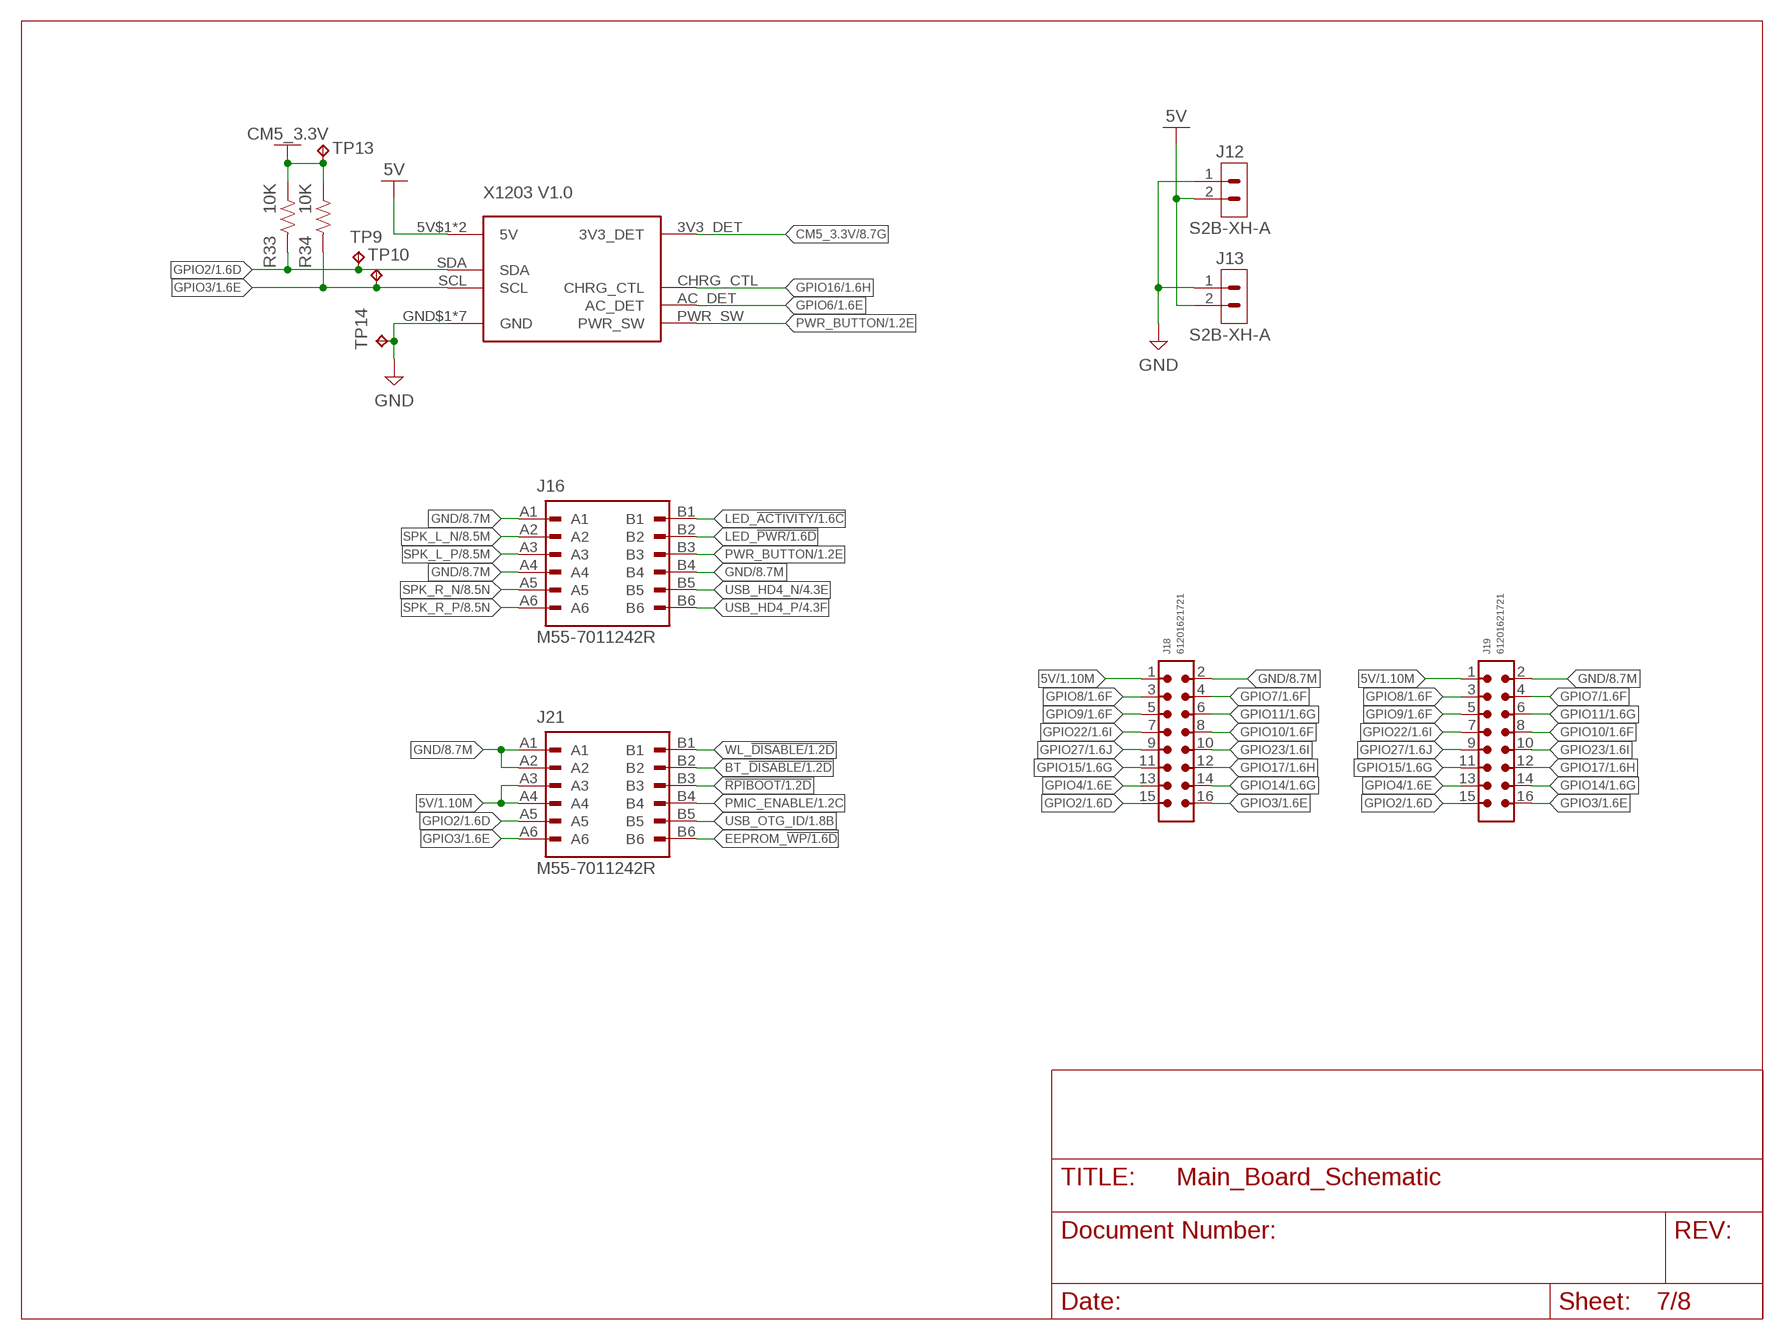
[diagram p6: schematic, sheet 7]

### Parts
J12  S2B-XH-A  [S2B-XH-A]
J13  S2B-XH-A  [S2B-XH-A]
J16  M55-7011242R  [HARWIN_M55-7011242R]
J18  61201621721  6120XX21721_61201621721  [61201621721]
J19  61201621721  6120XX21721_61201621721  [61201621721]
J21  M55-7011242R  [HARWIN_M55-7011242R]
R33  10K  R-US_CHIP-0805(2012-METRIC)  [RESC2012X65]
R34  10K  R-US_CHIP-0805(2012-METRIC)  [RESC2012X65]
TP9  TPB1,27  [B1,27]
TP10  TPB1,27  [B1,27]
TP13  TPB1,27  [B1,27]
TP14  TPB1,27  [B1,27]
U$1  X1203  [X1203]

### Nets
5V: J12.2 J13.2 J18.1 J19.1 J21.A3 J21.A4 U$1.5V$1(5V) U$1.5V$2(5V) ; also sheet 1,2,3,6,8
!RPIBOOT: J21.B3 ; also sheet 1
BT_!DISABLE: J21.B2 ; also sheet 1
CM5_3.3V: R33.2 R34.2 TP13.TP U$1.3V3_DET ; also sheet 1,2,3,4,5,8
EEPROM_!WP: J21.B6 ; also sheet 1
GND: J12.1 J13.1 J16.A1 J16.A4 J16.B4 J18.2 J19.2 J21.A1 J21.A2 TP14.TP U$1.GND$1(GND) U$1.GND$2(GND) U$1.GND$3(GND) U$1.GND$4(GND) U$1.GND$5(GND) U$1.GND$6(GND) U$1.GND$7(GND) ; also sheet 1,2,3,4,5,6,8
GPIO2: J18.15 J19.15 J21.A5 R33.1 TP9.TP U$1.SDA ; also sheet 1
GPIO3: J18.16 J19.16 J21.A6 R34.1 TP10.TP U$1.SCL ; also sheet 1
GPIO4: J18.13 J19.13 ; also sheet 1
GPIO6: U$1.AC_DET ; also sheet 1
GPIO7: J18.4 J19.4 ; also sheet 1
GPIO8: J18.3 J19.3 ; also sheet 1
GPIO9: J18.5 J19.5 ; also sheet 1
GPIO10: J18.8 J19.8 ; also sheet 1
GPIO11: J18.6 J19.6 ; also sheet 1
GPIO14: J18.14 J19.14 ; also sheet 1
GPIO15: J18.11 J19.11 ; also sheet 1
GPIO16: U$1.CHRG_CTL ; also sheet 1
GPIO17: J18.12 J19.12 ; also sheet 1
GPIO22: J18.7 J19.7 ; also sheet 1
GPIO23: J18.10 J19.10 ; also sheet 1
GPIO27: J18.9 J19.9 ; also sheet 1
LED_!ACTIVITY: J16.B1 ; also sheet 1
LED_!PWR: J16.B2 ; also sheet 1
PMIC_ENABLE: J21.B4 ; also sheet 1
PWR_BUTTON: J16.B3 U$1.PWR_SW ; also sheet 1
SPK_L_N [Audio]: J16.A2 ; also sheet 8
SPK_L_P [Audio]: J16.A3 ; also sheet 8
SPK_R_N [Audio]: J16.A5 ; also sheet 8
SPK_R_P [Audio]: J16.A6 ; also sheet 8
USB_HD4_N [90 ohm]: J16.B5 ; also sheet 4
USB_HD4_P [90 ohm]: J16.B6 ; also sheet 4
USB_OTG_ID: J21.B5 ; also sheet 1
WL_!DISABLE: J21.B1 ; also sheet 1

## Sheet 8 of 8
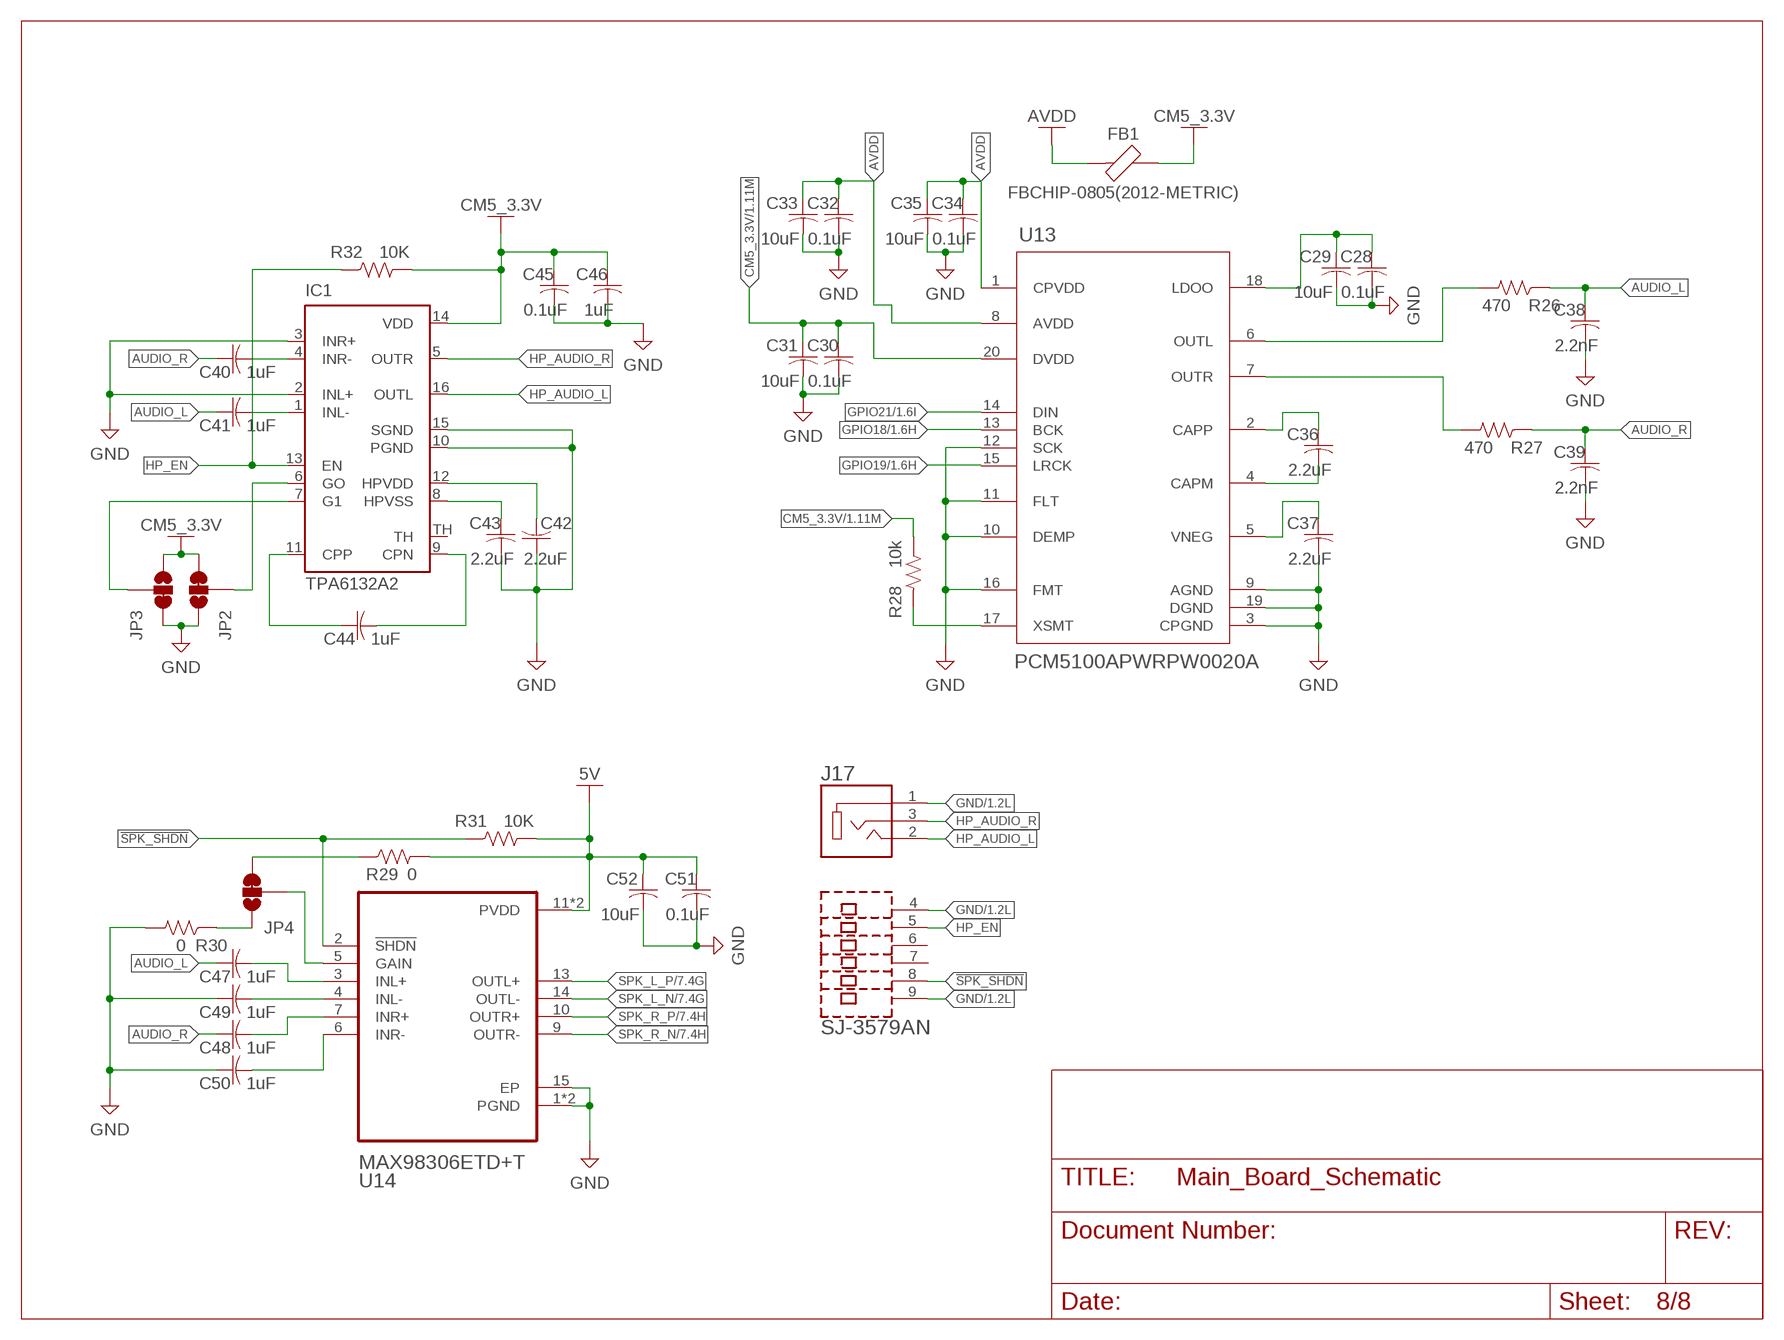
[diagram p7: schematic, sheet 8]

### Parts
C28  0.1uF  C-US_CHIP-0805(2012-METRIC)  [CAPC2012X110]
C29  10uF  C-US_CHIP-1206(3216-METRIC)  [CAPC3216X135]
C30  0.1uF  C-US_CHIP-0805(2012-METRIC)  [CAPC2012X110]
C31  10uF  C-US_CHIP-1206(3216-METRIC)  [CAPC3216X135]
C32  0.1uF  C-US_CHIP-0805(2012-METRIC)  [CAPC2012X110]
C33  10uF  C-US_CHIP-1206(3216-METRIC)  [CAPC3216X135]
C34  0.1uF  C-US_CHIP-0805(2012-METRIC)  [CAPC2012X110]
C35  10uF  C-US_CHIP-1206(3216-METRIC)  [CAPC3216X135]
C36  2.2uF  C-US_CHIP-0805(2012-METRIC)  [CAPC2012X110]
C37  2.2uF  C-US_CHIP-0805(2012-METRIC)  [CAPC2012X110]
C38  2.2nF  C-US_CHIP-0805(2012-METRIC)  [CAPC2012X110]
C39  2.2nF  C-US_CHIP-0805(2012-METRIC)  [CAPC2012X110]
C40  1uF  C-US_CHIP-0805(2012-METRIC)  [CAPC2012X110]
C41  1uF  C-US_CHIP-0805(2012-METRIC)  [CAPC2012X110]
C42  2.2uF  C-US_CHIP-0805(2012-METRIC)  [CAPC2012X110]
C43  2.2uF  C-US_CHIP-0805(2012-METRIC)  [CAPC2012X110]
C44  1uF  C-US_CHIP-0805(2012-METRIC)  [CAPC2012X110]
C45  0.1uF  C-US_CHIP-0805(2012-METRIC)  [CAPC2012X110]
C46  1uF  C-US_CHIP-0805(2012-METRIC)  [CAPC2012X110]
C47  1uF  C-US_CHIP-0805(2012-METRIC)  [CAPC2012X110]
C48  1uF  C-US_CHIP-0805(2012-METRIC)  [CAPC2012X110]
C49  1uF  C-US_CHIP-0805(2012-METRIC)  [CAPC2012X110]
C50  1uF  C-US_CHIP-0805(2012-METRIC)  [CAPC2012X110]
C51  0.1uF  C-US_CHIP-0805(2012-METRIC)  [CAPC2012X110]
C52  10uF  C-US_CHIP-1206(3216-METRIC)  [CAPC3216X135]
FB1  FBCHIP-0805(2012-METRIC)  [BEADC2012X105N]
IC1  TPA6132A2  [QFN16]
J17  SJ-3579AN  [CUI_SJ-3579AN]
JP2  JUMPER-SMT_3_1-NC_TRACE_SILK  [SMT-JUMPER_3_1-NC_TRACE_SILK]
JP3  JUMPER-SMT_3_1-NC_TRACE_SILK  [SMT-JUMPER_3_1-NC_TRACE_SILK]
JP4  JUMPER-SMT_3_1-NC_TRACE_SILK  [SMT-JUMPER_3_1-NC_TRACE_SILK]
R26  470  R-US_CHIP-0805(2012-METRIC)  [RESC2012X65]
R27  470  R-US_CHIP-0805(2012-METRIC)  [RESC2012X65]
R28  10k  R-US_CHIP-0805(2012-METRIC)  [RESC2012X65]
R29  0  R-US_CHIP-0805(2012-METRIC)  [RESC2012X65]
R30  0  R-US_CHIP-0805(2012-METRIC)  [RESC2012X65]
R31  10K  R-US_CHIP-0805(2012-METRIC)  [RESC2012X65]
R32  10K  R-US_CHIP-0805(2012-METRIC)  [RESC2012X65]
U13  PCM5100APWRPW0020A  [PW0020A]
U14  MAX98306ETD+T  [SON40P300X300X80-15N]

### Nets
5V: C51.1 C52.1 R29.2 R31.2 U14.11(PVDD) U14.12(PVDD) ; also sheet 1,2,3,6,7
!SPK_SHDN: J17.8 R31.1 U14.2(!SHDN)
AUDIO_L [Audio]: C38.1 C41.1 C47.1 R26.1
AUDIO_R [Audio]: C39.1 C40.1 C48.1 R27.1
AVDD: C32.1 C33.1 C34.1 C35.1 FB1.1 U13.1(CPVDD) U13.8(AVDD)
CM5_3.3V: C30.1 C31.1 C45.1 C46.1 FB1.2 IC1.14(VDD) JP2.3 JP3.1 R28.2 R32.2 U13.20(DVDD) ; also sheet 1,2,3,4,5,7
GND: C28.2 C29.2 C30.2 C31.2 C32.2 C33.2 C34.2 C35.2 C37.2 C38.2 C39.2 C42.1 C43.2 C45.2 C46.2 C49.1 C50.1 C51.2 C52.2 IC1.2(INL+) IC1.3(INR+) IC1.10(PGND) IC1.15(SGND) J17.1 J17.4 J17.9 JP2.1 JP3.3 R30.2 U13.3(CPGND) U13.9(AGND) U13.10(DEMP) U13.11(FLT) U13.12(SCK) U13.16(FMT) U13.19(DGND) U14.1(PGND) U14.8(PGND) U14.15(EP) ; also sheet 1,2,3,4,5,6,7
GPIO18: U13.13(BCK) ; also sheet 1
GPIO19: U13.15(LRCK) ; also sheet 1
GPIO21: U13.14(DIN) ; also sheet 1
HP_AUDIO_L [Audio]: IC1.16(OUTL) J17.2
HP_AUDIO_R [Audio]: IC1.5(OUTR) J17.3
HP_EN: IC1.13(EN) J17.5 R32.1
HP_G0: IC1.6(GO) JP2.2
HP_G1: IC1.7(G1) JP3.2
N$19: R26.2 U13.6(OUTL)
N$20: R27.2 U13.7(OUTR)
N$21: C28.1 C29.1 U13.18(LDOO)
N$22: C36.1 U13.2(CAPP)
N$23: C36.2 U13.4(CAPM)
N$24: C37.1 U13.5(VNEG)
N$25: R28.1 U13.17(XSMT)
N$26: C41.2 IC1.1(INL-)
N$27: C40.2 IC1.4(INR-)
N$28: C43.1 IC1.8(HPVSS)
N$29: C42.2 IC1.12(HPVDD)
N$30: C44.2 IC1.9(CPN)
N$31: C44.1 IC1.11(CPP)
N$32: C49.2 U14.4(INL-)
N$33: C48.2 U14.7(INR+)
N$34: C47.2 U14.3(INL+)
N$35: C50.2 U14.6(INR-)
N$36: JP4.2 U14.5(GAIN)
N$38: JP4.1 R30.1
N$39: JP4.3 R29.1
SPK_L_N [Audio]: U14.14(OUTL-) ; also sheet 7
SPK_L_P [Audio]: U14.13(OUTL+) ; also sheet 7
SPK_R_N [Audio]: U14.9(OUTR-) ; also sheet 7
SPK_R_P [Audio]: U14.10(OUTR+) ; also sheet 7
Unconnected: IC1.TH J17.6 J17.7

## Library data of the parts
BT1 = Battery_Holder:COIN-CELL-SMT-3P-?-: Battery Holders - Coin Cell SMD - CR2032 | LR44 | SR44 etc. Reference: Datasheet <https://docs.rs-online.com/b397/0900766b813ec0e2.pdf>; CATEGORY: Battery Holders; CELL_DIAMETER: 20mm; DATASHEET: https://www.keyelco.com/userAssets/file/M65p9.pdf; DESCRIPTION: Battery Retainer Coin 20.0mm 1 Cell SMD (SMT) Tab; MANUFACTURER: Keystone Electronics; MPN: 3002; OPERATING_TEMPERATURE: NA; PACKAGE_SIZE: 2016; PACKAGE_TYPE: Surface Mount; PART_STATUS: Active; ROHS: Compliant; SERIES: NA; SUBCATEGORY: Coin Cell Holder; TYPE: Retainer
C1-C8 C11-C13 C21 C26-C28 C30 C32 C34 C36-C51 = Capacitor:C-US: Capacitor - ANSI; CATEGORY: Capacitor; PACKAGE_SIZE: 0805; PACKAGE_TYPE: Surface Mount; SUBCATEGORY: Ceramic Capacitors; TYPE: MLCC
C9 C10 C14-C17 C19 C20 C22-C25 C29 C31 C33 C35 C52 = Capacitor:C-US: Capacitor - ANSI; CATEGORY: Capacitor; PACKAGE_SIZE: 1206; PACKAGE_TYPE: Surface Mount; SUBCATEGORY: Ceramic Capacitors; TYPE: MLCC
C18 = Capacitor:C-POL-US: Capacitor Polarised - ANSI; CATEGORY: Capacitor; PACKAGE_SIZE: 1411; PACKAGE_TYPE: Surface Mount; SUBCATEGORY: Tantalum Capacitors; TYPE: Polymer Capacitors
D1-D5 = TPD2EUSB30DRTR:TPD2EUSB30DRTR
FB1 = Filter:FB: Ferrite Bead - Generic; CATEGORY: Ferrite Bead; DESCRIPTION: Generic Ferrite Bead 0805 (2012 Metric); PACKAGE_SIZE: 0805; PACKAGE_TYPE: Surface Mount
IC1 = texas:TPA6132A2: 25-mW DIRECTPATH (TM) STEREO HEADPHONE AMPLIFIER WITH POP SUPPRESSION Source: www.ti.com .. tpa6132a2 direct path stereo $.65.pdf; MPN: TPA6132A2RTET; OC_FARNELL: 1697167; OC_NEWARK: 46P3781
J1 = FH12-22S-0.5SH:FH12-22S-0.5SH(55); COPYRIGHT: Copyright (C) 2025 Ultra Librarian. All rights reserved.; MANUFACTURER_NAME: Hirose; MANUFACTURER_PART_NUMBER: FH12-22S-0.5SH(55)
J2 J3 = HD05-19-TH-TR:HD05-19-TH-TR; MANUFACTURER: Same Sky; MAXIMUM_PACKAGE_HEIGHT: 6.32mm; PARTREV: 1.0; STANDARD: Manufacturer Recommendations
J4 = Wurth_Connectors_WR-USB:614104190121: WR-COM USB 2.0 Type A Horizontal THT Short Type Kind Properties Durability:5000 Mating cycles Quality Class:5000 Mating cycles Connector Type:USB Gender:Receptacle Type:Horizontal - Short Type General Information Operating Temperature:-55up to +85 °C Compliance:RoHS Electrical Properties IR 1:1.5A Working Voltage:30V (AC) Withstanding Voltage:500 V (AC) Contact Resistance:30 mΩ Material Properties Insulator Material:LCP Insulator Flammability Rating:UL94 V-0 Color:Black Contact Material:Copper Alloy Contact Plating: Gold Contact Type:Stamped Cover Material:Stainless Steel Cover Plating:Nickel <https://www.we-online.com/catalog/media/o58998v209%20Family_WR-COM_614104190121_4C.jpg> Details see: https://www.we-online.com/catalog/en/COM_THT_TYPE_A_HORIZONTAL/ Updated by Ella Wu 2021-09-28 2021 (C) Würth Elektronik; APPLICATION: USB 2.0; DATASHEET-URL: https://www.we-online.com/redexpert/spec/614104190121?ae; GERDER: Receptacle; INTERFACE-TYPE: Type A; MOUNT: THT; PACKAGING: Tape and Reel & Mylar; PART-NUMBER: 614104190121; PINS: 4pcs; TYPE: Horizontal - Short Type; WORKING-VOLTAGE: 30VAC
J5 J6 J9 J11 = UJ20-C-R-G-TH-2-P14-TR_:UJ20-C-R-G-TH-2-P14-TR; MANUFACTURER: Same Sky; MAXIMUM_PACKAGE_HEIGHT: 8.94mm; PARTREV: 1.01; STANDARD: Manufacturer Recommendations
J7 = 1-2199119-5:1-2199119-5; CHECK_PRICES: https://www.snapeda.com/parts/1-2199119-5/TE+Connectivity+AMP+Connectors/view-part/?ref=eda; COMMENT: 1-2199119-5; DESCRIPTION: M.2 0.5PITCH 3.2H KEY M 15Uinch AU, M.2 Connectors | TE Connectivity 1-2199119-5; DIGIKEY_PART_NUMBER: A115902CT-ND; MF: TE Connectivity; MP: 1-2199119-5; PACKAGE: None; SNAPEDA_LINK: https://www.snapeda.com/parts/1-2199119-5/TE+Connectivity+AMP+Connectors/view-part/?ref=snap
J8 = JST SH 4:SM04B-SRSS-TB; COPYRIGHT: Copyright (C) 2024 Ultra Librarian. All rights reserved.; MANUFACTURER_PART_NUMBER: SM04B-SRSS-TB; MFR_NAME: JST
J10 = L8BE-1G1T-BFH:L8BE-1G1T-BFH; MANUFACTURER: Bel Fuse; MAXIMUM_PACKAGE_HEIGHT: 10.7 mm; PARTREV: A; STANDARD: Manufacturer Recommendations
J12 J13 = Connector:S2B-XH-A: CONN HEADER R/A 2POS 2.5MM Reference: Datasheet <http://www.jst-mfg.com/product/pdf/eng/eXH.pdf>; CATEGORY: Connectors; DATASHEET: https://www.jst-mfg.com/product/pdf/eng/eXH.pdf; DESCRIPTION: Connector Header Through Hole- Right Angle 2 position 0.098" (2.50mm); MANUFACTURER: JST Sales America Inc.; MPN: S2B-XH-A-1; OPERATING_TEMPERATURE: -25°C ~ 85°C; PACKAGE_SIZE: NA; PACKAGE_TYPE: Through Hole; PART_STATUS: Active; PITCH: 0.098" (2.50mm); ROHS: Compliant; SERIES: XH; SUBCATEGORY: Rectangular Connectors; TYPE: Male Headers
J14 = 2328702-8:2328702-8; MANUFACTURER: TE Connectivity; MAXIMUM_PACKAGE_HEIGHT: 1.1mm; PARTREV: 5; STANDARD: Manufacturer Recommendations
J16 J21 = M55-7011242R:M55-7011242R; MANUFACTURER: Harwin; MAXIMUM_PACKAGE_HEIGHT: 8.0mm; PARTREV: 8; STANDARD: Manufacturer Recommendations
J17 = SJ-3579AN:SJ-3579AN; MF: CUI Inc; PARTREV: 1.01; STANDARD: Manufacturer recommendations
J18 J19 = Wurth_Connectors_WR-BHD:6120XX21721_61201621721: WR-BHD 2.54 mm Male Angled Box Header KIND PROPERTIES: Pitch 2.54 mm Gender:Male MATERIAL PROPERTIES: Insulator Material:PBT Insulator Flammability Rating UL94 V-0 Insulator Color:Black Contact Material :Copper Alloy Contact Plating :Gold Contact Type: Stamped GENERAL INFORMATION: Operating Temperature:-40 °C up to +125 °C Compliance:RoHS Working Voltage: 250 V (AC) Withstanding Voltage:500 V (AC) Contact Resistance: 20 mΩ Insulation Resistance:1000 MΩ CERTIFICATION: UL Approval:E323964 PACKAGING PROPERTIES Packaging :Tray <https://www.we-online.de/katalog/media/o32888v209%20Family_WR-BHD_6120xx21721.jpg> Details see: https://www.we-online.de/katalog/en/em/BHD_2_54_MALE_ANGLED_BOX_HEADER_6120XX21721 Updated by Yingchun,Shan 2019-10-29 2019 (C) Würth Elektronik; CONTACT-RESISTANCE-MAX: 20mOhm; COUNT: 1; DATASHEET-URL: https://www.we-online.com/redexpert/spec/61201621721?ae; GENDER: Male PCB side; IR: 3A; LENGTH: 27.98mm; MOUNT: THT; PACKAGING: Tray; PART-NUMBER: 61201621721; PINS: 16; PITCH: 2.54mm; TYPE: Angled; VERSION: Low Profile; WORKING-VOLTAGE: 250VAC
JP1-JP4 = SparkFun-Jumpers:JUMPER-SMT_3_1-NC_TRACE: Normally closed trace jumper (1 of 2 connections) This jumper has a trace between two pads so it's normally closed (NC). The other connection is normally open (NO). Use a razor knife to open the connection. For best results follow the IPC guidelines for cutting traces: Cutout at least 0.063 mm (0.005 in). Remove all loose material to clean up the cut area. Seal the cut with an approved epoxy. Reapply solder to reclose the connection, or to close the NO connection.
L1 = Wurth_Power Magnetics_WE-XHMI:WE-XHMI_5030: WE-XHMI SMT Power Inductor Shielded Characteristicscs Flat wire coil for low copper losses Composite core material allows high saturation currents Compact design Magnetically shielded High current capability and handles high transient current spikes Low leakage flux noise Operating temperature: -40°C up to +125°C WE-XHMI Performance: Operating temperature: -55°C up to +150°C Optimized for ultra low RDC and AC losses to enhance efficiency and minimize self-heating WE-XHMI: Operating temperature: -40°C up to +125°C Reliable inductor featuring a balanced combination of low losses and high current capability Applications DC/DC-converter for high current power supplies DC/DC-converter for Field Programmable Gate Array (FPGA) Power supplies for mobile devices POL-converters Mainboards/ graphic cards Battery powered devices Wireless communication devices Filter <https://www.we-online.com/components/media/o14900v209%20FAMILY-WE-XHMI.jpg> Details see: www.we-online.com/en/components/products/WE-XHMI <www.we-online.com/catalog/WE-XHMI/?utm_source=eagle_model&utm_medium=description_link&utm_campaign=eisos_eagle> Updated by Ella Wu 2024-09-18 2024 (C) Würth Elektronik; DATASHEET-URL: https://www.we-online.com/redexpert/spec/74439334022?ae; FRES: 35MHz; HEIGHT: 3mm; IRP: 10.3A@40K; ISAT: 12.8A@30%; L: 2.2uH; LENGTH: 5.55mm; MOUNT: SMT; PART-NUMBER: 74439334022; RDC-MAX: 14.52mOhm; RDC-TYP: 11.3mOhm; SIZE: 5030; WIDTH: 5.35mm
R1-R34 = Resistor:R-US: Resistor Fixed - ANSI; CATEGORY: Resistors; DESCRIPTION: Chip Resistor 2.00 X 1.25 X 0.65 mm body 0805(2012-METRIC) Package; PACKAGE_SIZE: 0805; PACKAGE_TYPE: Surface Mount
TP1-TP14 = testpad:TP: Test pad
U1 = CM5108064B:CM5108064B: Check availability <https://pricing.snapeda.com/parts/CM5108064B/Raspberry%20Pi/view-part?ref=eda>; AVAILABILITY: Not in stock; CHECK_PRICES: https://www.snapeda.com/parts/CM5108064B/Raspberry+Pi/view-part/?ref=eda; CONNECTOR: 2 x (10164227-1001A1RLF); DESCRIPTION: Cm5 8Gb 64Gb Wifibt, Bulk |Raspberry-Pi CM5108064B; MF: Raspberry Pi; MP: CM5108064B; PACKAGE: None; PRICE: None; SNAPEDA_LINK: https://www.snapeda.com/parts/CM5108064B/Raspberry+Pi/view-part/?ref=snap
U2 = RT9742SNGV:RT9742SNGV; COPYRIGHT: Copyright (C) 2024 Ultra Librarian. All rights reserved.; MANUFACTURER_PART_NUMBER: RT9742SNGV; MFR_NAME: Richtek Technology
U3 = AP22653W6-7:AP22653W6-7: Power Switch/Driver 1:1 P-Channel 2.1A SOT-23-6; MANUFACTURER: Diodes Inc.; MAXIMUM_PACKAGE_HEIGHT: 1.45 mm; PARTREV: 2-2; STANDARD: IPC 7351B
U4 = USB2514B/M2:USB2514B/M2; COPYRIGHT: Copyright (C) 2024 Ultra Librarian. All rights reserved.; MANUFACTURER_PART_NUMBER: USB2514B/M2; MFR_NAME: Microchip
U5 = FSUSB42MUX:FSUSB42MUX; MANUFACTURER: ON Semiconductor; PARTREV: 1.25; STANDARD: IPC-7351B
U6-U11 = TPD4EUSB30DQAR:TPD4EUSB30DQAR; MANUFACTURER: Texas Instruments; MAXIMUM_PACKAGE_HEIGHT: 0.55 mm; PARTREV: F; STANDARD: Manufacturer Recommendations
U12 = 2025-09-13_21-13-28_Library:AP3441SHE-7B; COPYRIGHT: Copyright (C) 2025 Ultra Librarian. All rights reserved.; MANUFACTURER_NAME: Diodes Inc; MANUFACTURER_PART_NUMBER: AP3441SHE-7B
U13 = PCM5100APWR:PCM5100APWR; COPYRIGHT: Copyright (C) 2024 Ultra Librarian. All rights reserved.; MANUFACTURER_PART_NUMBER: PCM5100APWR; MFR_NAME: Texas Instruments; REFDES: RefDes; TYPE: TYPE
U14 = MAX98306ETD_T:MAX98306ETD+T; AVAILABILITY: Unavailable; DESCRIPTION: Audio Amp Speaker 2-CH Stereo 3.7W Class-D 14-Pin TDFN EP; MF: Maxim Integrated; MP: MAX98306ETD+T; PACKAGE: TDFN-14 Maxim; PRICE: None
U$1 = X1203:X1203
Y1 = Wurth_Quartz Crystals &amp; Oscillators_WE-XTAL:WE-XTAL_CFPX-180: WE-XTAL Quartz Crystal Characteristics SMT and THT models Hermetically sealed Frequencies between 1.8432 MHz and 50 MHz Tolerances down to ±10 ppm available Maximum operating temperatures range: -40 °C to 85 °C Stabilities down to ±10 ppm available Applications Microprocessor Wireless Communication Devices Industrial Devices Wired Communication (e.g. Ethernet and USB) IoT Optical Network Audio and Multimedia Devices Test and Measurement Equipment Navigation and Locators Wearables <https://www.we-online.com/components/media/o135919v209%20WE%20XTAL%20Group.jpg> Details see: www.we-online.com/en/components/products/WE-XTAL <www.we-online.com/catalog/WE-XTAL/?utm_source=eagle_model&utm_medium=description_link&utm_campaign=eisos_eagle> Updated by Ella 2025-03-10 2025 (C) Würth Elektronik; C-LOAD: 18pF; DATASHEET-URL: https://www.we-online.com/redexpert/spec/830058124?ae; FREQUENCY: 24 MHz; HEIGHT: 0.8mm; LENGTH: 3.2mm; MOUNT: SMT; OPERATING-TEMPERATURE: -40 °C up to +85 °C; PART-NUMBER: 830058124; SIZE: CFPX-180; STABILITY: 30ppm; TOLERANCE: ±20ppm; WIDTH: 2.5mm
Y2 = ASEK-32.768KHZ-L-R-T:ASEK-32.768KHZ-L-R-T; MANUFACTURER: Abracon; MAXIMUM_PACKAGE_HEIGHT: 1.2 mm; PARTREV: 01-11-22; SNAPEDA_PN: ASEK-32.768KHZ-L-R-T; STANDARD: Manufacturer Recommendations

## Net classes
1 Audio: width 0.203 mm, clearance 0.178 mm
2 100 ohm: width 0.178 mm, clearance 0.152 mm
3 90 ohm: width 0.191 mm, clearance 0.105 mm